# EAGLE design uMotion_v1.0 (EAGLE 9.2.1)

## Sheet 1 of 3
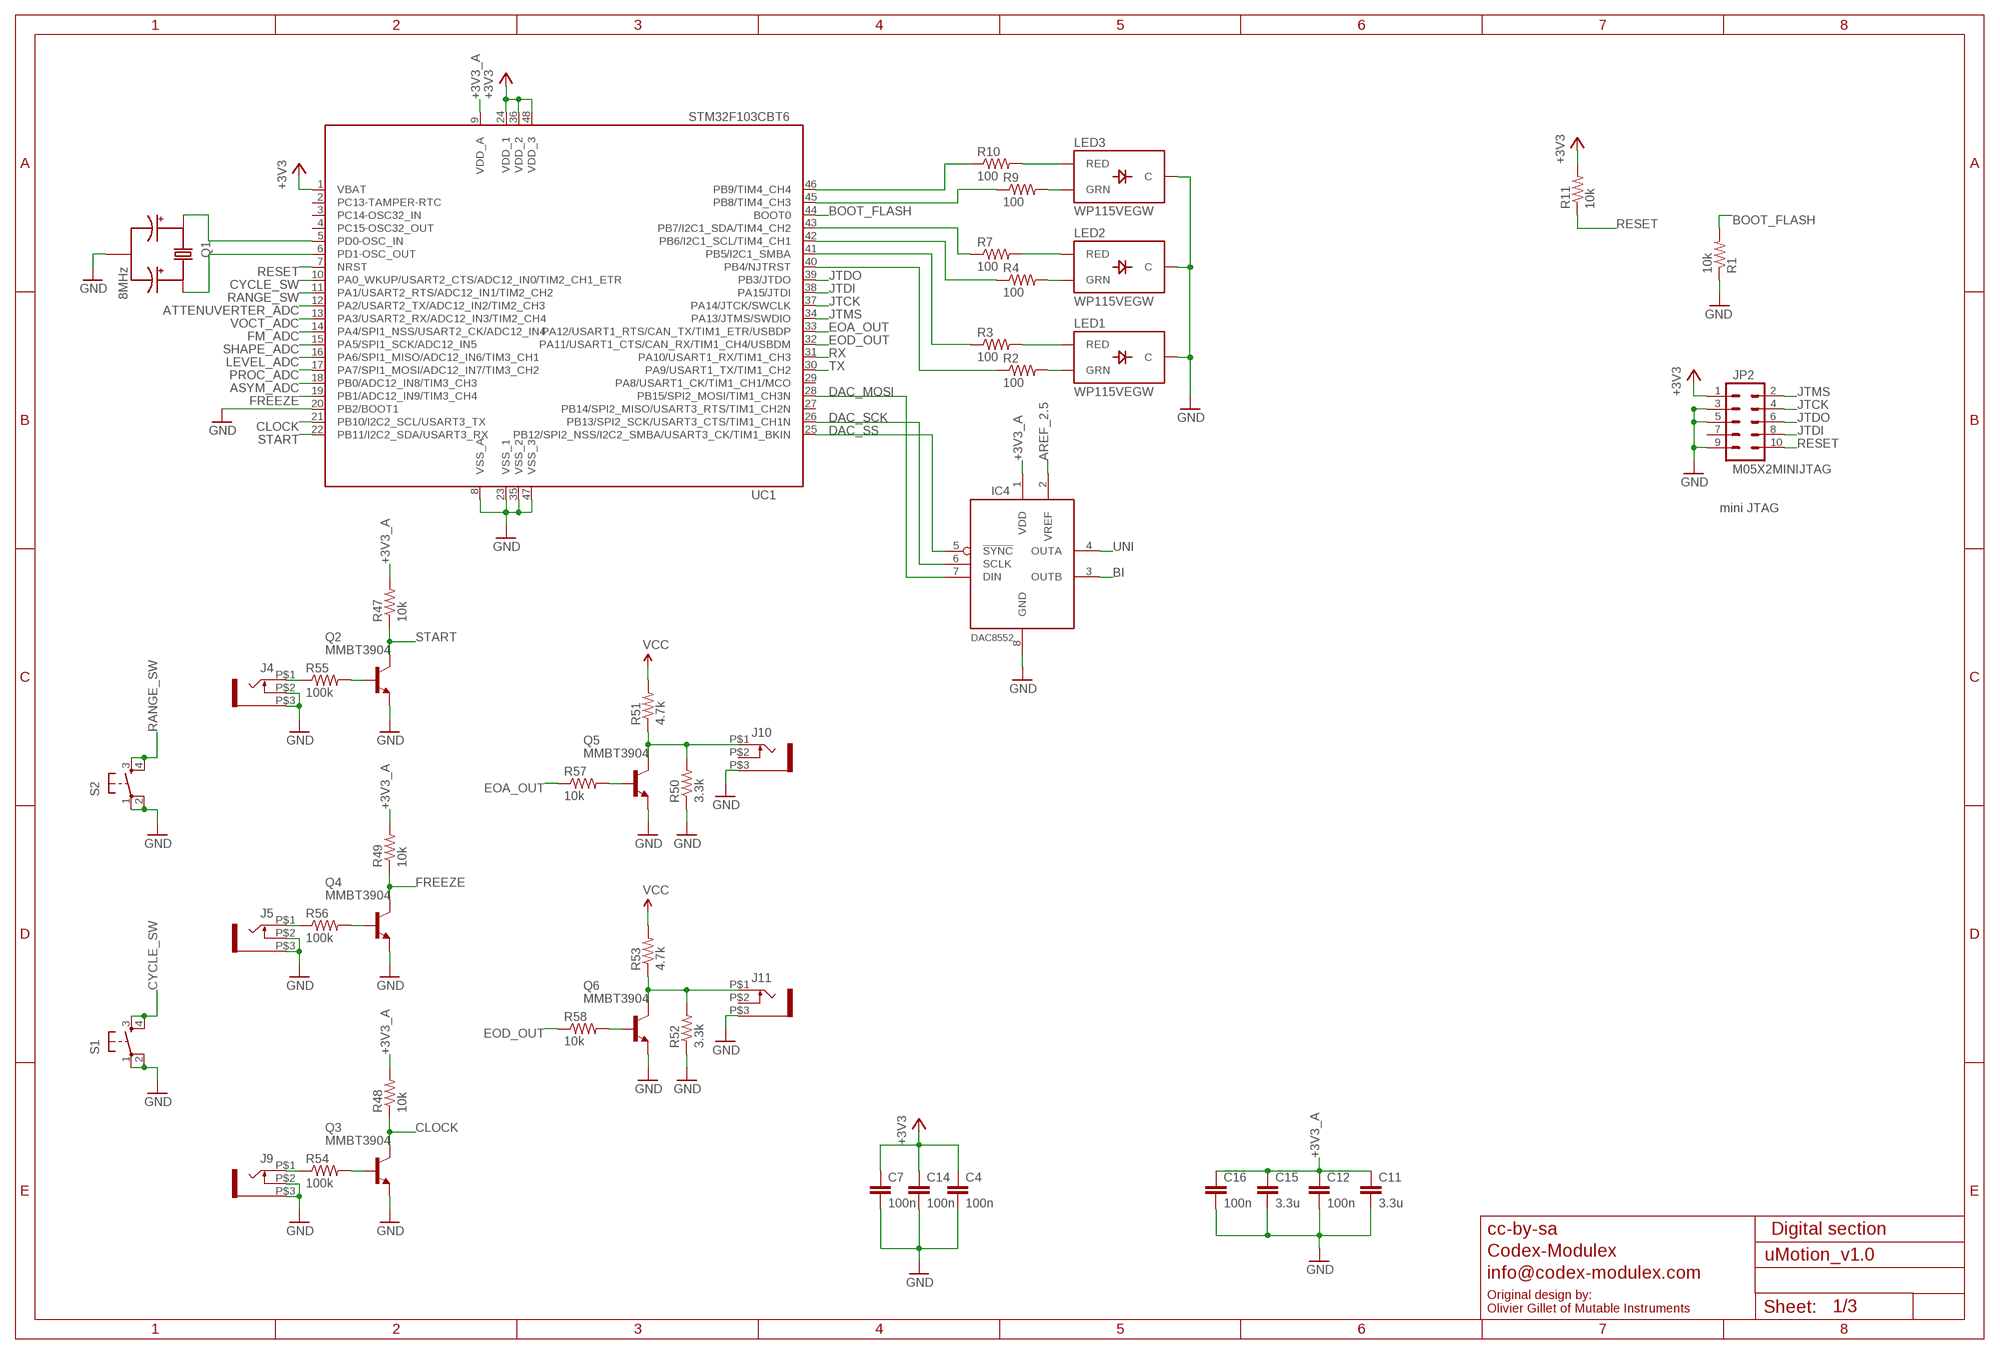
[diagram p0: schematic, sheet 1]

### Parts
C4  100n  PARTS_AMAN_CAPACITOR  [PARTS_AMAN_RESISTOR_0603]
C7  100n  PARTS_AMAN_CAPACITOR  [PARTS_AMAN_RESISTOR_0603]
C11  3.3u  PARTS_AMAN_CAPACITOR  [PARTS_AMAN_RESISTOR_0603]
C12  100n  PARTS_AMAN_CAPACITOR  [PARTS_AMAN_RESISTOR_0603]
C14  100n  PARTS_AMAN_CAPACITOR  [PARTS_AMAN_RESISTOR_0603]
C15  3.3u  PARTS_AMAN_CAPACITOR  [PARTS_AMAN_RESISTOR_0603]
C16  100n  PARTS_AMAN_CAPACITOR  [PARTS_AMAN_RESISTOR_0603]
IC4  DAC8552  [MSOP-8]
J4  WQP-PJ301M-12_JACK  [WQP-PJ301M-12_JACK]
J5  WQP-PJ301M-12_JACK  [WQP-PJ301M-12_JACK]
J9  WQP-PJ301M-12_JACK  [WQP-PJ301M-12_JACK]
J10  WQP-PJ301M-12_JACK  [WQP-PJ301M-12_JACK]
J11  WQP-PJ301M-12_JACK  [WQP-PJ301M-12_JACK]
JP2  M05X2MINIJTAG  [2X5-1.27]
LED1  WP115VEGW  LED-BICOLOR-THROUGHHOLE  [LED-BICOLOR-THROUGHHOLE]
LED2  WP115VEGW  LED-BICOLOR-THROUGHHOLE  [LED-BICOLOR-THROUGHHOLE]
LED3  WP115VEGW  LED-BICOLOR-THROUGHHOLE  [LED-BICOLOR-THROUGHHOLE]
Q1  8MHz  INSTRUO_CRYSTAL_SMALLER  [INSTRUO_CRYSTAL_SMALLER]
Q2  MMBT3904  MMBT3904LT1-NPN-SOT23-BEC  [SOT23-BEC]
Q3  MMBT3904  MMBT3904LT1-NPN-SOT23-BEC  [SOT23-BEC]
Q4  MMBT3904  MMBT3904LT1-NPN-SOT23-BEC  [SOT23-BEC]
Q5  MMBT3904  MMBT3904LT1-NPN-SOT23-BEC  [SOT23-BEC]
Q6  MMBT3904  MMBT3904LT1-NPN-SOT23-BEC  [SOT23-BEC]
R1  10k  PARTS_AMAN_RESISTOR  [PARTS_AMAN_RESISTOR_0603]
R2  100  PARTS_AMAN_RESISTOR  [PARTS_AMAN_RESISTOR_0603]
R3  100  PARTS_AMAN_RESISTOR  [PARTS_AMAN_RESISTOR_0603]
R4  100  PARTS_AMAN_RESISTOR  [PARTS_AMAN_RESISTOR_0603]
R7  100  PARTS_AMAN_RESISTOR  [PARTS_AMAN_RESISTOR_0603]
R9  100  PARTS_AMAN_RESISTOR  [PARTS_AMAN_RESISTOR_0603]
R10  100  PARTS_AMAN_RESISTOR  [PARTS_AMAN_RESISTOR_0603]
R11  10k  PARTS_AMAN_RESISTOR  [PARTS_AMAN_RESISTOR_0603]
R47  10k  PARTS_AMAN_RESISTOR  [PARTS_AMAN_RESISTOR_0603]
R48  10k  PARTS_AMAN_RESISTOR  [PARTS_AMAN_RESISTOR_0603]
R49  10k  PARTS_AMAN_RESISTOR  [PARTS_AMAN_RESISTOR_0603]
R50  3.3k  PARTS_AMAN_RESISTOR  [PARTS_AMAN_RESISTOR_0603]
R51  4.7k  PARTS_AMAN_RESISTOR  [PARTS_AMAN_RESISTOR_0603]
R52  3.3k  PARTS_AMAN_RESISTOR  [PARTS_AMAN_RESISTOR_0603]
R53  4.7k  PARTS_AMAN_RESISTOR  [PARTS_AMAN_RESISTOR_0603]
R54  100k  PARTS_AMAN_RESISTOR  [PARTS_AMAN_RESISTOR_0603]
R55  100k  PARTS_AMAN_RESISTOR  [PARTS_AMAN_RESISTOR_0603]
R56  100k  PARTS_AMAN_RESISTOR  [PARTS_AMAN_RESISTOR_0603]
R57  10k  PARTS_AMAN_RESISTOR  [PARTS_AMAN_RESISTOR_0603]
R58  10k  PARTS_AMAN_RESISTOR  [PARTS_AMAN_RESISTOR_0603]
S1  TAC_SWITCHPTH  [TACTILE-PTH]
S2  TAC_SWITCHPTH  [TACTILE-PTH]
UC1  STM32F103CBT6  STM32F103CB  [LQFP48]

### Nets
+3V3: C4.1 C7.1 C14.1 JP2.1 R11.2 UC1.1(VBAT) UC1.24(VDD_1) UC1.36(VDD_2) UC1.48(VDD_3) ; also sheet 3
+3V3_A: C11.1 C12.1 C15.1 C16.1 IC4.1(VDD) R47.2 R48.2 R49.2 UC1.9(VDD_A) ; also sheet 2,3
AREF_2.5: IC4.2(VREF) ; also sheet 3
ASYM_ADC: UC1.18(PB0/ADC12_IN8/TIM3_CH3) ; also sheet 2
ATTENUVERTER_ADC: UC1.12(PA2/USART2_TX/ADC12_IN2/TIM2_CH3) ; also sheet 2
BI: IC4.3(OUTB) ; also sheet 2
BOOT_FLASH: R1.2 UC1.44(BOOT0)
CLOCK: Q3.C R48.1 UC1.21(PB10/I2C2_SCL/USART3_TX)
CYCLE_SW: S1.3 S1.4 UC1.10(PA0_WKUP/USART2_CTS/ADC12_IN0/TIM2_CH1_ETR)
DAC_MOSI: IC4.7(DIN) UC1.28(PB15/SPI2_MOSI/TIM1_CH3N)
DAC_SCK: IC4.6(SCLK) UC1.26(PB13/SPI2_SCK/USART3_CTS/TIM1_CH1N)
DAC_SS: IC4.5(!SYNC) UC1.25(PB12/SPI2_NSS/I2C2_SMBA/USART3_CK/TIM1_BKIN)
EOA_OUT: R57.1 UC1.33(PA12/USART1_RTS/CAN_TX/TIM1_ETR/USBDP)
EOD_OUT: R58.1 UC1.32(PA11/USART1_CTS/CAN_RX/TIM1_CH4/USBDM)
FM_ADC: UC1.14(PA4/SPI1_NSS/USART2_CK/ADC12_IN4) ; also sheet 2
FREEZE: Q4.C R49.1 UC1.19(PB1/ADC12_IN9/TIM3_CH4)
GND: C4.2 C7.2 C11.2 C12.2 C14.2 C15.2 C16.2 IC4.8(GND) J4.P$2 J4.P$3 J5.P$2 J5.P$3 J9.P$2 J9.P$3 J10.P$3 J11.P$3 JP2.3 JP2.5 JP2.9 LED1.2(C) LED2.2(C) LED3.2(C) Q1.GND Q2.E Q3.E Q4.E Q5.E Q6.E R1.1 R50.1 R52.1 S1.1 S1.2 S2.1 S2.2 UC1.8(VSS_A) UC1.20(PB2/BOOT1) UC1.23(VSS_1) UC1.35(VSS_2) UC1.47(VSS_3) ; also sheet 2,3
JTCK: JP2.4 UC1.37(PA14/JTCK/SWCLK)
JTDI: JP2.8 UC1.38(PA15/JTDI)
JTDO: JP2.6 UC1.39(PB3/JTDO)
JTMS: JP2.2 UC1.34(PA13/JTMS/SWDIO)
LEVEL_ADC: UC1.16(PA6/SPI1_MISO/ADC12_IN6/TIM3_CH1) ; also sheet 2
N$7: Q1.X2 UC1.6(PD1-OSC_OUT)
N$8: Q1.X1 UC1.5(PD0-OSC_IN)
N$21: J5.P$1 R56.1
N$23: Q4.B R56.2
N$24: J9.P$1 R54.1
N$25: Q3.B R54.2
N$26: Q6.B R58.2
N$27: J11.P$1 Q6.C R52.2 R53.1
N$28: LED3.3(RED) R10.2
N$29: LED3.1(GRN) R9.2
N$30: LED2.3(RED) R7.2
N$31: LED2.1(GRN) R4.2
N$32: LED1.3(RED) R3.2
N$33: LED1.1(GRN) R2.2
N$34: R10.1 UC1.46(PB9/TIM4_CH4)
N$35: R9.1 UC1.45(PB8/TIM4_CH3)
N$36: R7.1 UC1.43(PB7/I2C1_SDA/TIM4_CH2)
N$37: R4.1 UC1.42(PB6/I2C1_SCL/TIM4_CH1)
N$38: R3.1 UC1.41(PB5/I2C1_SMBA)
N$39: R2.1 UC1.40(PB4/NJTRST)
N$44: J10.P$1 Q5.C R50.2 R51.1
N$47: Q5.B R57.2
N$57: J4.P$1 R55.1
N$66: Q2.B R55.2
PROC_ADC: UC1.17(PA7/SPI1_MOSI/ADC12_IN7/TIM3_CH2) ; also sheet 2
RANGE_SW: S2.3 S2.4 UC1.11(PA1/USART2_RTS/ADC12_IN1/TIM2_CH2)
RESET: JP2.10 R11.1 UC1.7(NRST)
RX: UC1.31(PA10/USART1_RX/TIM1_CH3)
SHAPE_ADC: UC1.15(PA5/SPI1_SCK/ADC12_IN5) ; also sheet 2
START: Q2.C R47.1 UC1.22(PB11/I2C2_SDA/USART3_RX)
TX: UC1.30(PA9/USART1_TX/TIM1_CH2)
UNI: IC4.4(OUTA) ; also sheet 2
VCC: R51.2 R53.2 ; also sheet 2,3
VOCT_ADC: UC1.13(PA3/USART2_RX/ADC12_IN3/TIM2_CH4) ; also sheet 2
Unconnected: J10.P$2 J11.P$2 JP2.7 UC1.2(PC13-TAMPER-RTC) UC1.3(PC14-OSC32_IN) UC1.4(PC15-OSC32_OUT) UC1.27(PB14/SPI2_MISO/USART3_RTS/TIM1_CH2N) UC1.29(PA8/USART1_CK/TIM1_CH1/MCO)

### Notes on the sheet
- mini JTAG
- cc-by-sa | Digital section
- Codex-Modulex
- info@codex-modulex.com
- Original design by:
  Olivier Gillet of Mutable Instruments

## Sheet 2 of 3
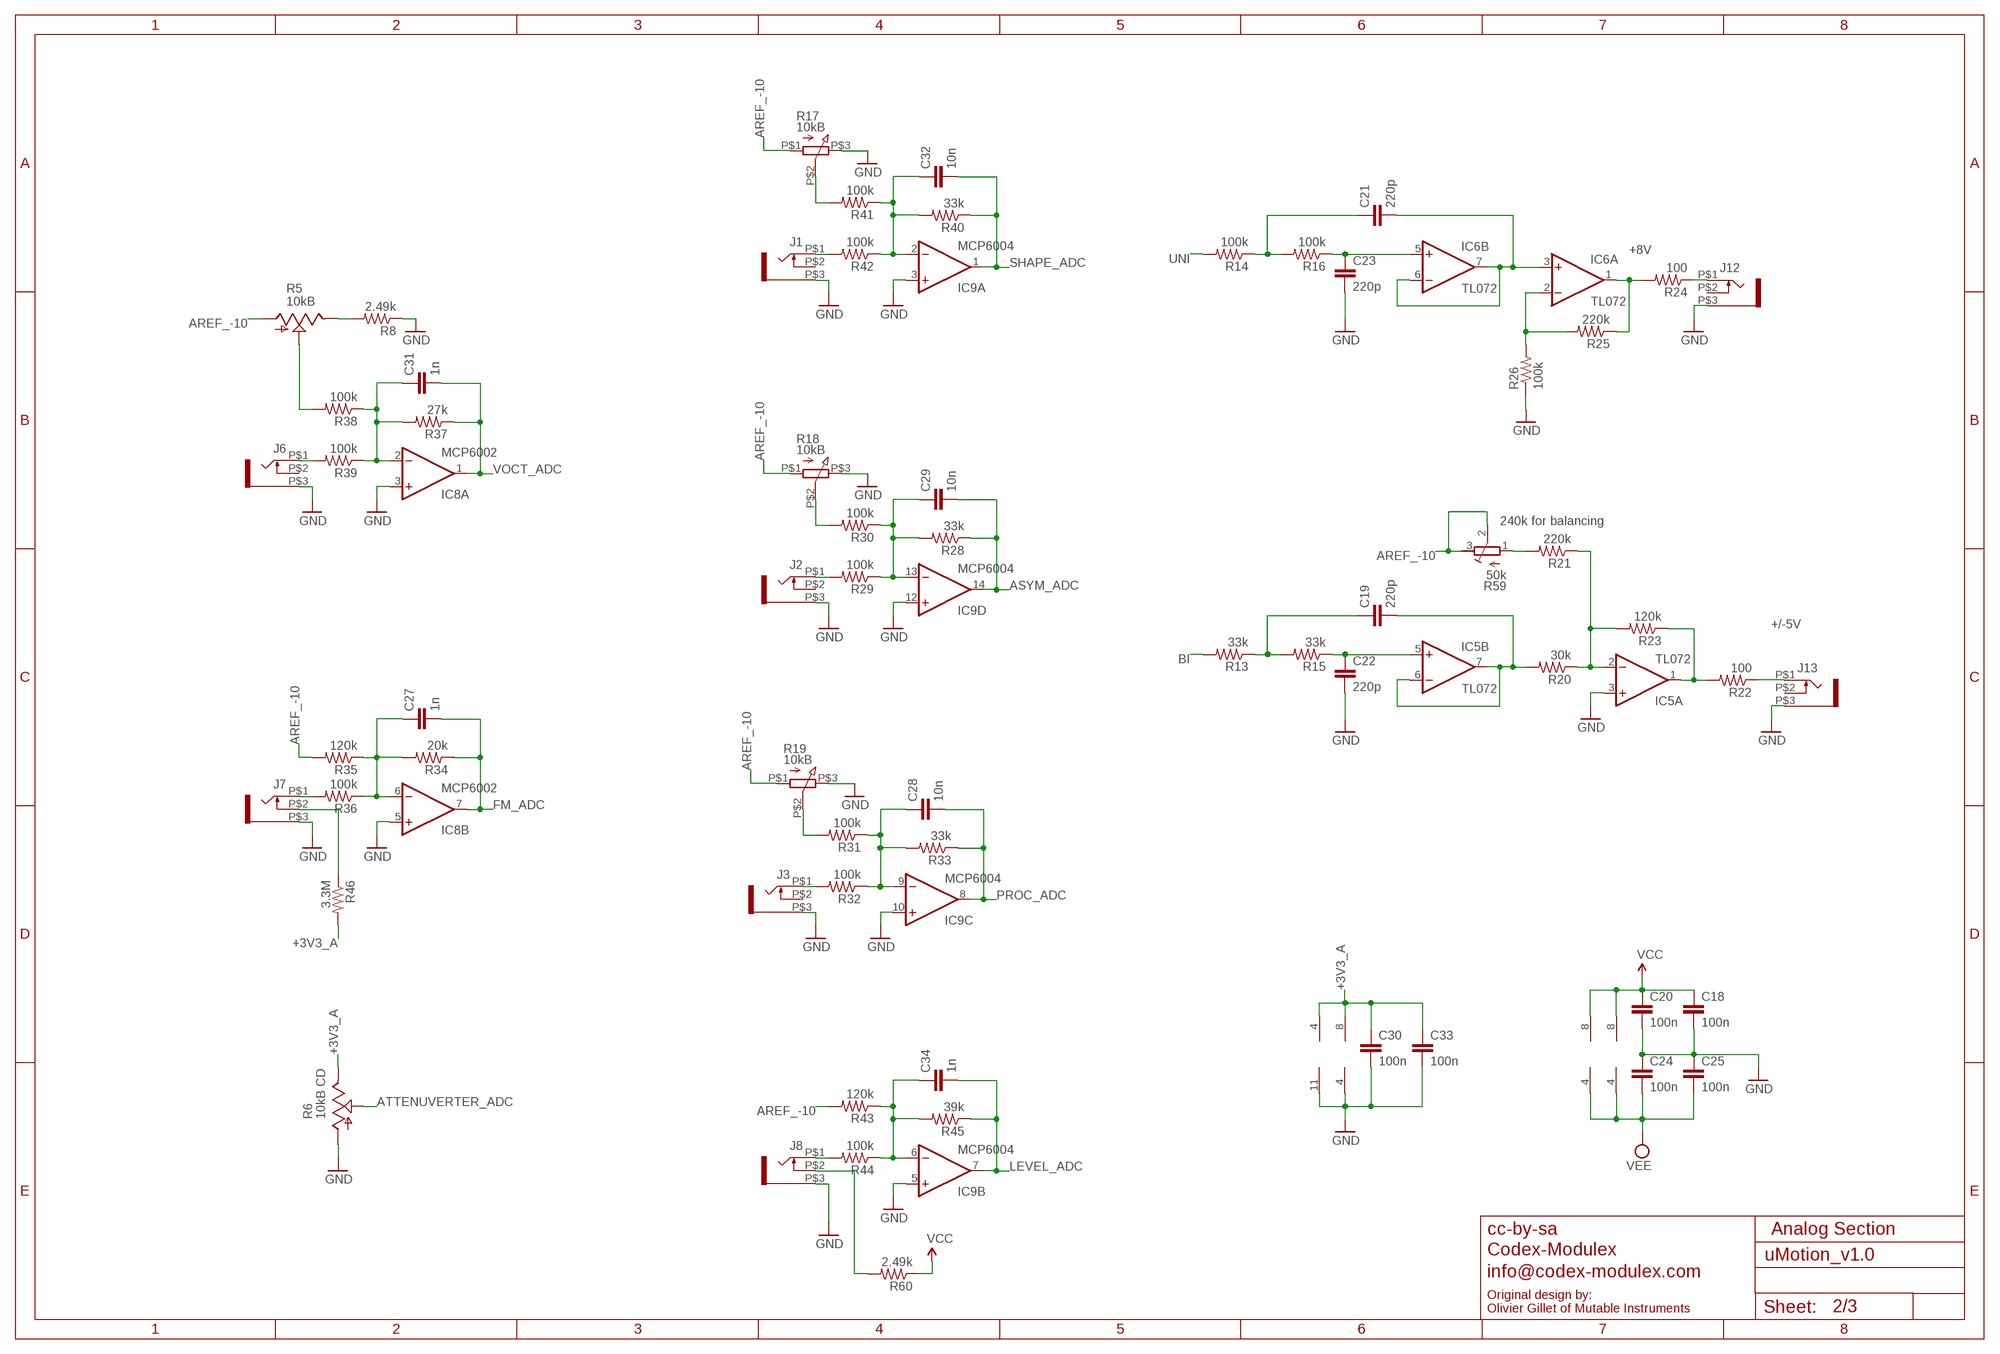
[diagram p1: schematic, sheet 2]

### Parts
C18  100n  PARTS_AMAN_CAPACITOR  [PARTS_AMAN_RESISTOR_0603]
C19  220p  PARTS_AMAN_CAPACITOR  [PARTS_AMAN_RESISTOR_0603]
C20  100n  PARTS_AMAN_CAPACITOR  [PARTS_AMAN_RESISTOR_0603]
C21  220p  PARTS_AMAN_CAPACITOR  [PARTS_AMAN_RESISTOR_0603]
C22  220p  PARTS_AMAN_CAPACITOR  [PARTS_AMAN_RESISTOR_0603]
C23  220p  PARTS_AMAN_CAPACITOR  [PARTS_AMAN_RESISTOR_0603]
C24  100n  PARTS_AMAN_CAPACITOR  [PARTS_AMAN_RESISTOR_0603]
C25  100n  PARTS_AMAN_CAPACITOR  [PARTS_AMAN_RESISTOR_0603]
C27  1n  PARTS_AMAN_CAPACITOR  [PARTS_AMAN_RESISTOR_0603]
C28  10n  PARTS_AMAN_CAPACITOR  [PARTS_AMAN_RESISTOR_0603]
C29  10n  PARTS_AMAN_CAPACITOR  [PARTS_AMAN_RESISTOR_0603]
C30  100n  PARTS_AMAN_CAPACITOR  [PARTS_AMAN_RESISTOR_0603]
C31  1n  PARTS_AMAN_CAPACITOR  [PARTS_AMAN_RESISTOR_0603]
C32  10n  PARTS_AMAN_CAPACITOR  [PARTS_AMAN_RESISTOR_0603]
C33  100n  PARTS_AMAN_CAPACITOR  [PARTS_AMAN_RESISTOR_0603]
C34  1n  PARTS_AMAN_CAPACITOR  [PARTS_AMAN_RESISTOR_0603]
IC5  TL072  TL072D  [SO08]
IC6  TL072  TL072D  [SO08]
IC8  MCP6002  TL072D  [SO08]
IC9  MCP6004  TL074D  [SO14]
J1  WQP-PJ301M-12_JACK  [WQP-PJ301M-12_JACK]
J2  WQP-PJ301M-12_JACK  [WQP-PJ301M-12_JACK]
J3  WQP-PJ301M-12_JACK  [WQP-PJ301M-12_JACK]
J6  WQP-PJ301M-12_JACK  [WQP-PJ301M-12_JACK]
J7  WQP-PJ301M-12_JACK  [WQP-PJ301M-12_JACK]
J8  WQP-PJ301M-12_JACK  [WQP-PJ301M-12_JACK]
J12  WQP-PJ301M-12_JACK  [WQP-PJ301M-12_JACK]
J13  WQP-PJ301M-12_JACK  [WQP-PJ301M-12_JACK]
R5  10kB  POT_USVERTICAL_PS  [ALPS_POT_VERTICAL_PS]
R6  10kB CD  POT_USVERTICAL_PS  [ALPS_POT_VERTICAL_PS]
R8  2.49k  PARTS_AMAN_RESISTOR  [PARTS_AMAN_RESISTOR_0603]
R13  33k  PARTS_AMAN_RESISTOR  [PARTS_AMAN_RESISTOR_0603]
R14  100k  PARTS_AMAN_RESISTOR  [PARTS_AMAN_RESISTOR_0603]
R15  33k  PARTS_AMAN_RESISTOR  [PARTS_AMAN_RESISTOR_0603]
R16  100k  PARTS_AMAN_RESISTOR  [PARTS_AMAN_RESISTOR_0603]
R17  10kB  INSTRUO_Q-POT2  [INSTRUO_Q-POT2]
R18  10kB  INSTRUO_Q-POT2  [INSTRUO_Q-POT2]
R19  10kB  INSTRUO_Q-POT2  [INSTRUO_Q-POT2]
R20  30k  PARTS_AMAN_RESISTOR  [PARTS_AMAN_RESISTOR_0603]
R21  220k  PARTS_AMAN_RESISTOR  [PARTS_AMAN_RESISTOR_0603]
R22  100  PARTS_AMAN_RESISTOR  [PARTS_AMAN_RESISTOR_0603]
R23  120k  PARTS_AMAN_RESISTOR  [PARTS_AMAN_RESISTOR_0603]
R24  100  PARTS_AMAN_RESISTOR  [PARTS_AMAN_RESISTOR_0603]
R25  220k  PARTS_AMAN_RESISTOR  [PARTS_AMAN_RESISTOR_0603]
R26  100k  PARTS_AMAN_RESISTOR  [PARTS_AMAN_RESISTOR_0603]
R28  33k  PARTS_AMAN_RESISTOR  [PARTS_AMAN_RESISTOR_0603]
R29  100k  PARTS_AMAN_RESISTOR  [PARTS_AMAN_RESISTOR_0603]
R30  100k  PARTS_AMAN_RESISTOR  [PARTS_AMAN_RESISTOR_0603]
R31  100k  PARTS_AMAN_RESISTOR  [PARTS_AMAN_RESISTOR_0603]
R32  100k  PARTS_AMAN_RESISTOR  [PARTS_AMAN_RESISTOR_0603]
R33  33k  PARTS_AMAN_RESISTOR  [PARTS_AMAN_RESISTOR_0603]
R34  20k  PARTS_AMAN_RESISTOR  [PARTS_AMAN_RESISTOR_0603]
R35  120k  PARTS_AMAN_RESISTOR  [PARTS_AMAN_RESISTOR_0603]
R36  100k  PARTS_AMAN_RESISTOR  [PARTS_AMAN_RESISTOR_0603]
R37  27k  PARTS_AMAN_RESISTOR  [PARTS_AMAN_RESISTOR_0603]
R38  100k  PARTS_AMAN_RESISTOR  [PARTS_AMAN_RESISTOR_0603]
R39  100k  PARTS_AMAN_RESISTOR  [PARTS_AMAN_RESISTOR_0603]
R40  33k  PARTS_AMAN_RESISTOR  [PARTS_AMAN_RESISTOR_0603]
R41  100k  PARTS_AMAN_RESISTOR  [PARTS_AMAN_RESISTOR_0603]
R42  100k  PARTS_AMAN_RESISTOR  [PARTS_AMAN_RESISTOR_0603]
R43  120k  PARTS_AMAN_RESISTOR  [PARTS_AMAN_RESISTOR_0603]
R44  100k  PARTS_AMAN_RESISTOR  [PARTS_AMAN_RESISTOR_0603]
R45  39k  PARTS_AMAN_RESISTOR  [PARTS_AMAN_RESISTOR_0603]
R46  3.3M  PARTS_AMAN_RESISTOR  [PARTS_AMAN_RESISTOR_0603]
R59  50k  R-TRIMM3296X  [RTRIM3296X]
R60  2.49k  R-US_R0805  [R0805]

### Nets
+3V3_A: C30.1 C33.1 IC8.8(P:V+) IC9.4(P:V+) R6.P$1(E) R46.2 ; also sheet 1,3
AREF_-10: R5.P$3(A) R17.P$1 R18.P$1 R19.P$1 R35.2 R43.2 R59.2(S) R59.3(A) ; also sheet 3
ASYM_ADC: C29.2 IC9.14(D:OUT) R28.1 ; also sheet 1
ATTENUVERTER_ADC: R6.P$2(S) ; also sheet 1
BI: R13.2 ; also sheet 1
BI_OUT: IC5.1(A:OUT) R22.2 R23.1
F_CV: IC5.2(A:-IN) R20.1 R21.1 R23.2
FM_ADC: C27.2 IC8.7(B:OUT) R34.1 ; also sheet 1
GND: C18.2 C20.2 C22.2 C23.2 C24.1 C25.1 C30.2 C33.2 IC5.3(A:+IN) IC8.3(A:+IN) IC8.4(P:V-) IC8.5(B:+IN) IC9.3(A:+IN) IC9.5(B:+IN) IC9.10(C:+IN) IC9.11(P:V-) IC9.12(D:+IN) J1.P$3 J2.P$3 J3.P$3 J6.P$3 J7.P$3 J8.P$3 J12.P$3 J13.P$3 R6.P$3(A) R8.1 R17.P$3 R18.P$3 R19.P$3 R26.1 ; also sheet 1,3
LEVEL_ADC: C34.2 IC9.7(B:OUT) R45.1 ; also sheet 1
N$1: J1.P$1 R42.2
N$2: C32.1 IC9.2(A:-IN) R40.2 R41.1 R42.1
N$3: R17.P$2 R41.2
N$4: J2.P$1 R29.2
N$5: C29.1 IC9.13(D:-IN) R28.2 R29.1 R30.1
N$6: J7.P$2 R46.1
N$9: R18.P$2 R30.2
N$10: J3.P$1 R32.2
N$11: C28.1 IC9.9(C:-IN) R31.1 R32.1 R33.2
N$12: R19.P$2 R31.2
N$13: J8.P$1 R44.2
N$14: C34.1 IC9.6(B:-IN) R43.1 R44.1 R45.2
N$15: J6.P$1 R39.2
N$16: C31.1 IC8.2(A:-IN) R37.2 R38.1 R39.1
N$17: R5.P$2(S) R38.2
N$18: J13.P$1 R22.1
N$19: R5.P$1(E) R8.2
N$20: J7.P$1 R36.2
N$22: C27.1 IC8.6(B:-IN) R34.2 R35.1 R36.1
N$40: R21.2 R59.1(E)
N$41: IC6.2(A:-IN) R25.2 R26.2
N$42: C19.2 IC5.6(B:-IN) IC5.7(B:OUT) R20.2
N$43: C22.1 IC5.5(B:+IN) R15.1
N$45: C19.1 R13.1 R15.2
N$46: IC6.1(A:OUT) R24.2 R25.1
N$48: J8.P$2 R60.2
N$67: C21.2 IC6.3(A:+IN) IC6.6(B:-IN) IC6.7(B:OUT)
N$69: C23.1 IC6.5(B:+IN) R16.1
N$71: C21.1 R14.1 R16.2
PROC_ADC: C28.2 IC9.8(C:OUT) R33.1 ; also sheet 1
SHAPE_ADC: C32.2 IC9.1(A:OUT) R40.1 ; also sheet 1
UNI: R14.2 ; also sheet 1
UNI_OUT: J12.P$1 R24.1
VCC: C18.1 C20.1 IC5.8(P:V+) IC6.8(P:V+) R60.1 ; also sheet 1,3
VEE: C24.2 C25.2 IC5.4(P:V-) IC6.4(P:V-) ; also sheet 3
VOCT_ADC: C31.2 IC8.1(A:OUT) R37.1 ; also sheet 1
Unconnected: J1.P$2 J2.P$2 J3.P$2 J6.P$2 J12.P$2 J13.P$2

### Notes on the sheet
- +8V
- 240k for balancing
- +/-5V
- cc-by-sa | Analog Section
- Codex-Modulex
- info@codex-modulex.com
- Original design by:
  Olivier Gillet of Mutable Instruments

## Sheet 3 of 3
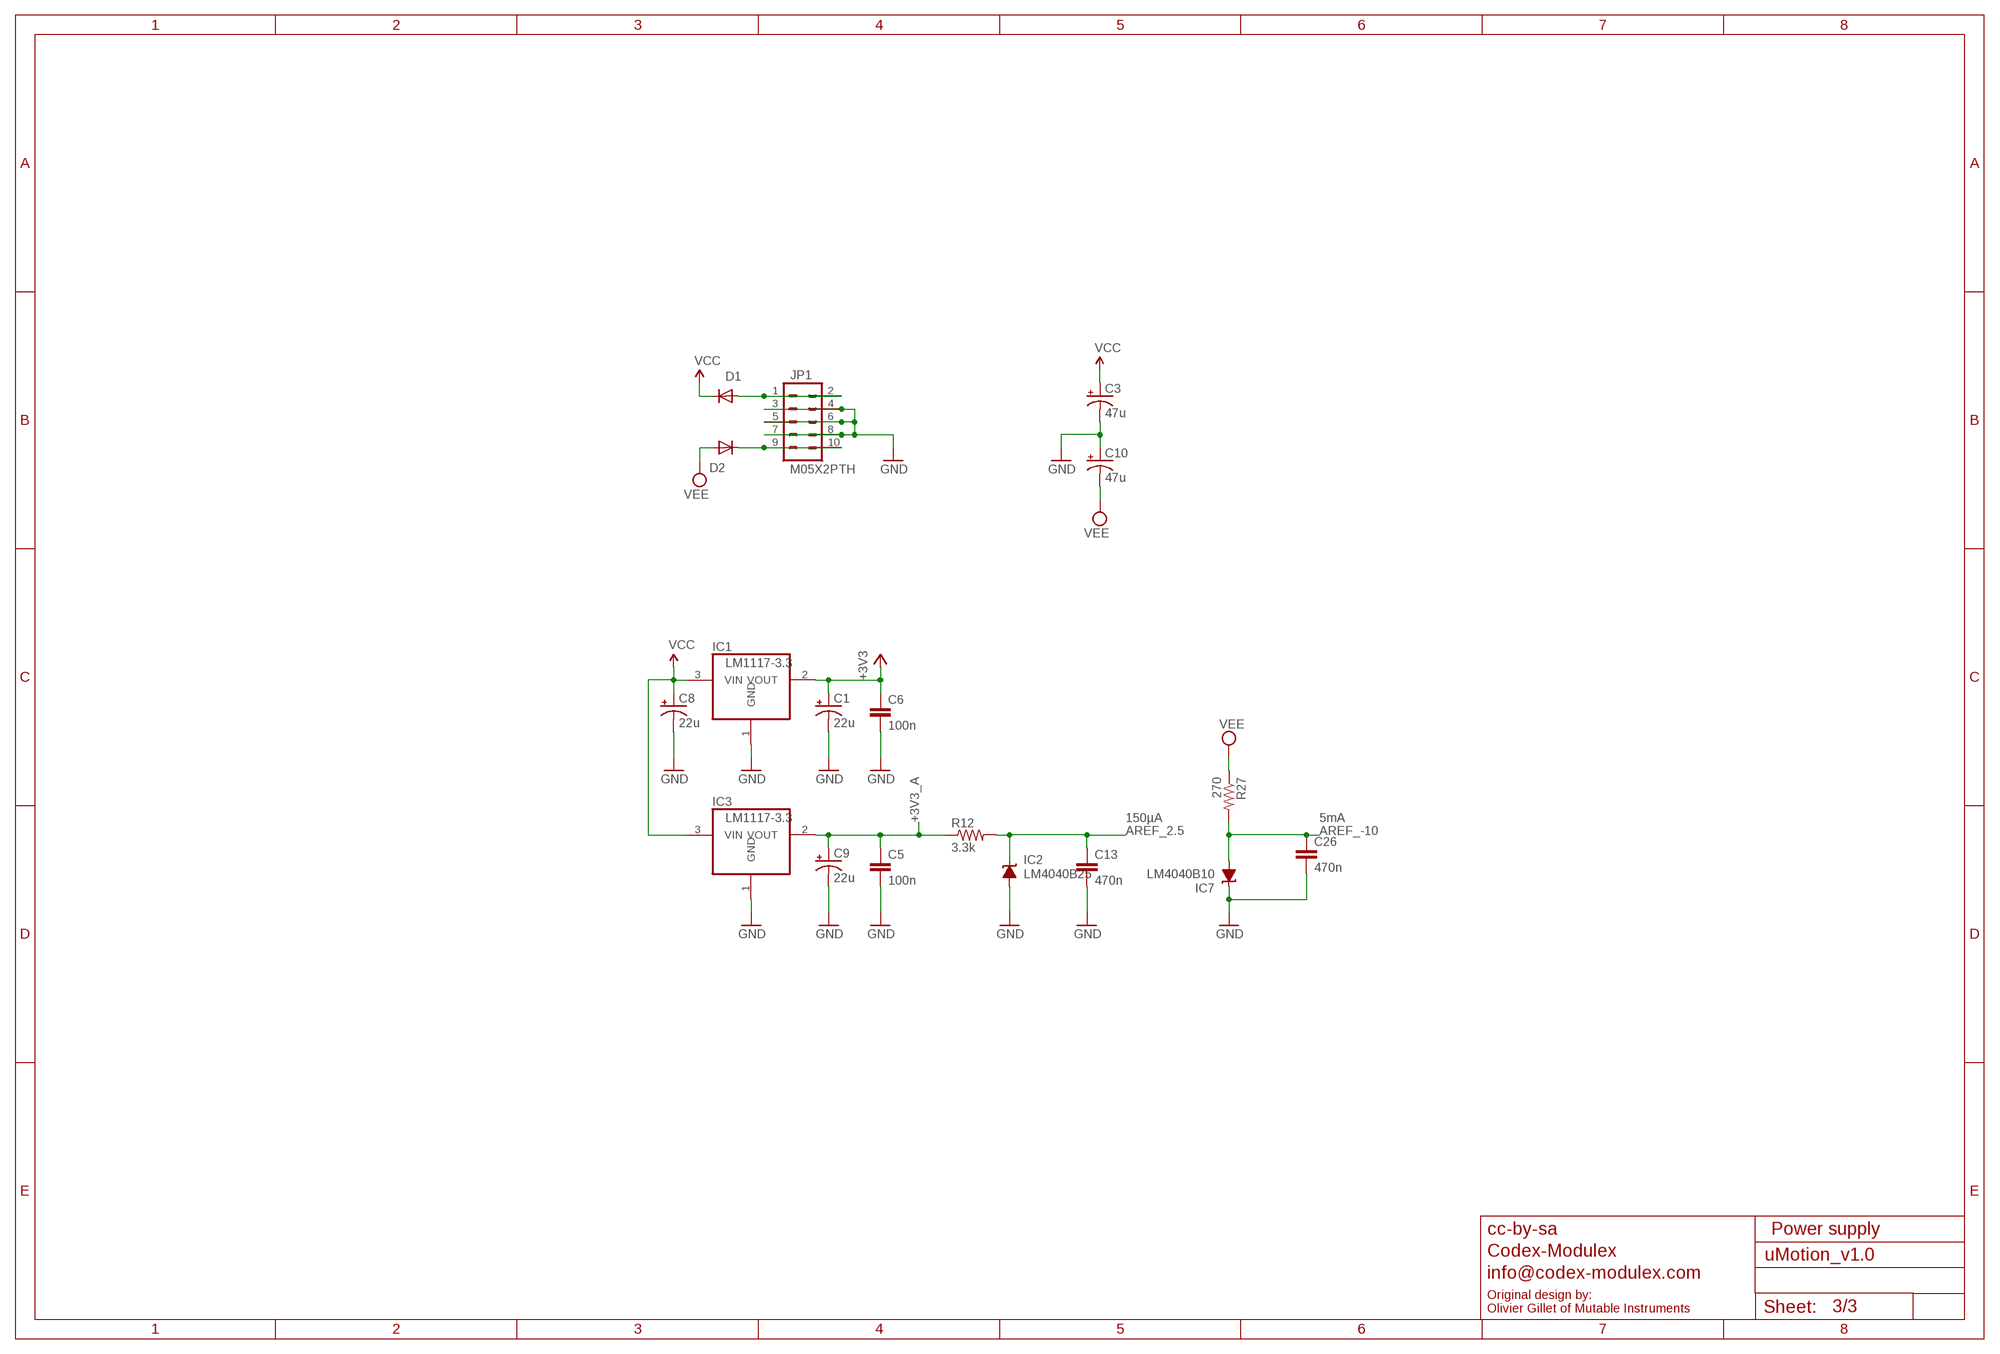
[diagram p2: schematic, sheet 3]

### Parts
C1  22u  CPOL-USC  [PANASONIC_C]
C3  47u  CPOL-USD  [PANASONIC_D]
C5  100n  PARTS_AMAN_CAPACITOR  [PARTS_AMAN_RESISTOR_0603]
C6  100n  PARTS_AMAN_CAPACITOR  [PARTS_AMAN_RESISTOR_0603]
C8  22u  CPOL-USC  [PANASONIC_C]
C9  22u  CPOL-USC  [PANASONIC_C]
C10  47u  CPOL-USD  [PANASONIC_D]
C13  470n  PARTS_AMAN_CAPACITOR  [PARTS_AMAN_RESISTOR_0603]
C26  470n  PARTS_AMAN_CAPACITOR  [PARTS_AMAN_RESISTOR_0603]
D1  1N5819HW  DIODE-SOD123  [SOD123]
D2  1N5819HW  DIODE-SOD123  [SOD123]
IC1  LM1117-3.3  REG1117  [SOT223]
IC2  LM4040B25  LM4041B12DBZ  [DBZ_R-PDSO-G3]
IC3  LM1117-3.3  REG1117  [SOT223]
IC7  LM4040B10  LM4041B12DBZ  [DBZ_R-PDSO-G3]
JP1  M05X2PTH  [AVR_ICSP]
R12  3.3k  PARTS_AMAN_RESISTOR  [PARTS_AMAN_RESISTOR_0603]
R27  270  PARTS_AMAN_RESISTOR  [PARTS_AMAN_RESISTOR_0603]

### Nets
+3V3: C1.+ C6.1 IC1.2(VOUT) ; also sheet 1
+3V3_A: C5.1 C9.+ IC3.2(VOUT) R12.1 ; also sheet 1,2
AREF_2.5: C13.1 IC2.1(C) R12.2 ; also sheet 1
AREF_-10: C26.1 IC7.2(A) R27.2 ; also sheet 2
GND: C1.- C3.- C5.2 C6.2 C8.- C9.- C10.+ C13.2 C26.2 IC1.1(GND) IC2.2(A) IC3.1(GND) IC7.1(C) JP1.3 JP1.4 JP1.5 JP1.6 JP1.7 JP1.8 ; also sheet 1,2
N$56: D1.A JP1.1 JP1.2
N$64: D2.C JP1.9 JP1.10
VCC: C3.+ C8.+ D1.C IC1.3(VIN) IC3.3(VIN) ; also sheet 1,2
VEE: C10.- D2.A R27.1 ; also sheet 2

### Notes on the sheet
- 150µA | 5mA
- cc-by-sa | Power supply
- Codex-Modulex
- info@codex-modulex.com
- Original design by:
  Olivier Gillet of Mutable Instruments

## Library data of the parts
C1 C3 C8-C10 = rcl:CPOL-US: POLARIZED CAPACITOR, American symbol
C4-C7 C11-C16 C18-C34 = atom_v1_1_board_2:PARTS_AMAN_CAPACITOR
D1 D2 = diode:DIODE-: DIODE
IC1 IC3 = og-vreg:REG1117: 800mA and 1A Low Dropout (LDO) Positive Regulator 1.8V, 2.5V, 2.85V, 3.3V, 5V, and Adj
IC2 IC7 = texas:LM4041: PRECISION MICROPOWER SHUNT VOLTAGE REFERENCE Source: http://focus.ti.com/lit/ds/slcs146e/slcs146e.pdf
IC4 = og-dac:DAC8552
IC5 IC6 IC8 = linear:TL072: OP AMP
IC9 = gm-ics:TL074: OP AMP
J1-J13 = thonkiconn:WQP-PJ301M-12_JACK
JP1 JP2 = og-header:M05X2: Header 5x2 Standard 10-pin dual row 0.1" header. Commonly used with AVR-ISP. Use with Spark Fun Electronics SKU: PRT-00778
LED1-LED3 = og-leds:LED-BICOLOR-THROUGHHOLE
Q1 = uClouds_002_:INSTRUO_CRYSTAL_SMALLER: CSTCE16M0V53-R0
Q2-Q6 = transistor:*-NPN-: NPN Transistror BF959 corrected 2008.03.06
R1-R4 R7-R16 R20-R58 = atom_v1_1_board_2:PARTS_AMAN_RESISTOR
R5 R6 = pot-alps:POT_US
R17-R19 = uClouds_002_:INSTRUO_Q-POT2
R59 = rcl:R-TRIMM: Trimm resistor
R60 = resistor:R-US_: RESISTOR, American symbol
S1 S2 = uClouds_002:TAC_SWITCH: Momentary Switch Button commonly used for reset or general input. Spark Fun Electronics SKU : COM-00097
UC1 = stm32:STM32F103CB

## Board
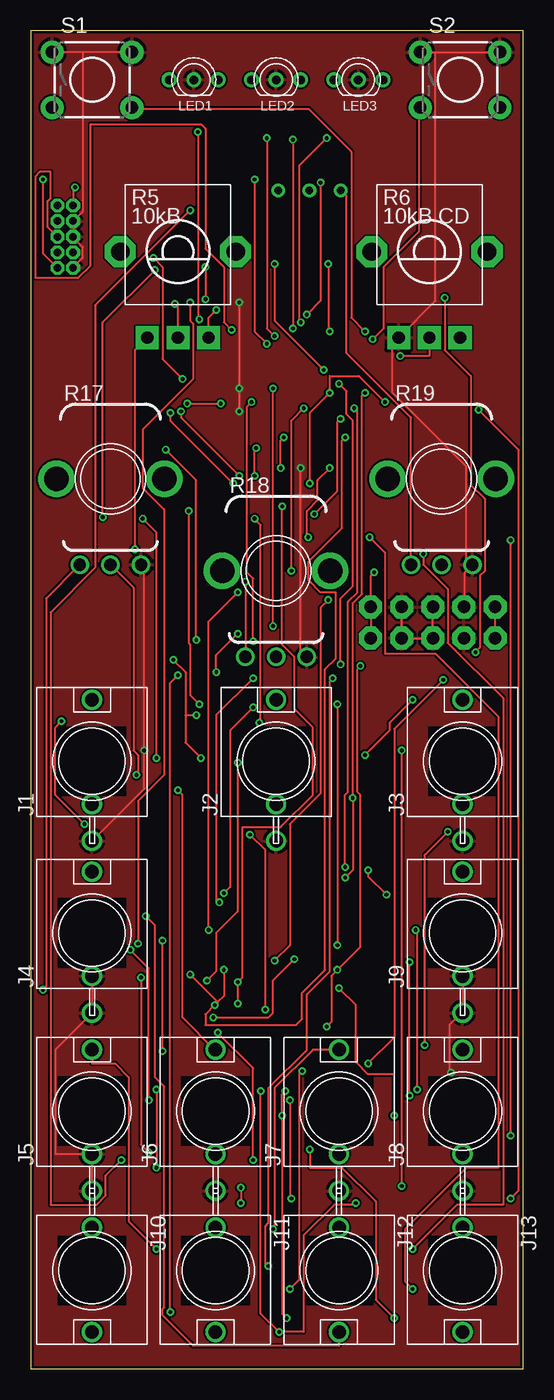
[diagram p3: board, top side]
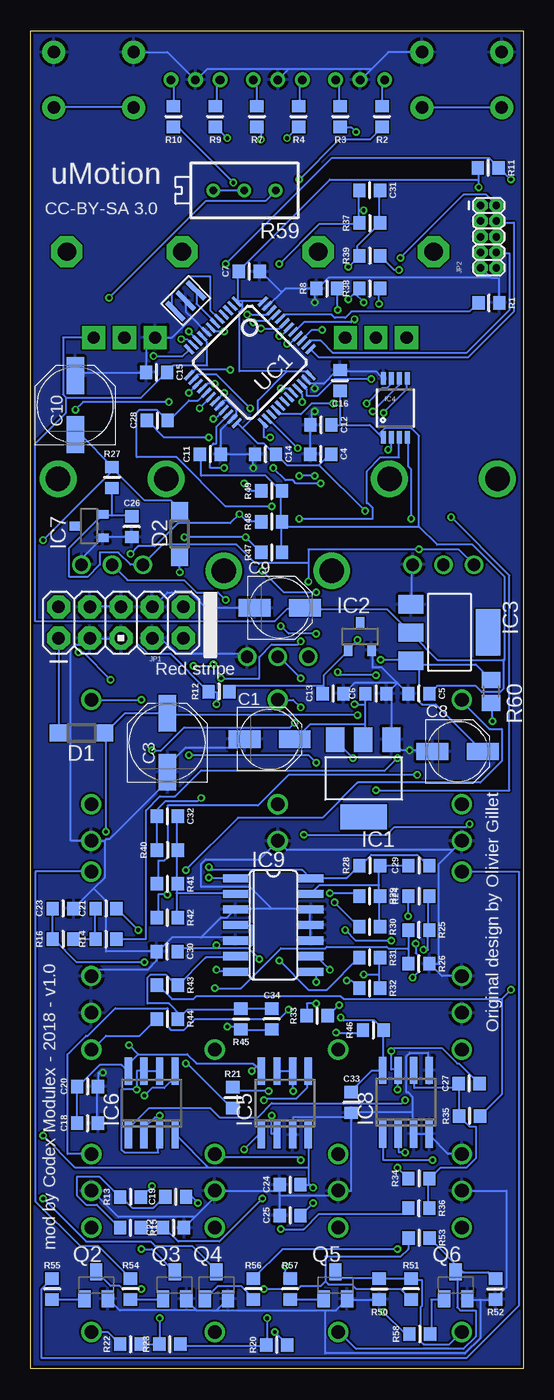
[diagram p4: board, bottom side, seen from below]

Size 40.14 x 109 mm. Coordinates in mm from the lower left corner, seen from the top.
Outline: 0,0 40.14,0 40.14,109 0,109 0,0
Copper layers (1*16): Top 0.035mm / dielectric 1.5mm / Bottom 0.035mm
Design rules "dirt_cheap_dirty_boards.v1.1": minimum track width 6mil, minimum drill 12mil, track to track 6mil, track to pad 6mil, pad to pad 6mil, via to via 6mil, smd to smd 0mil, copper to edge 10mil, drill to drill 10mil, minimum pad ring 10mil, minimum via ring 6mil, stop-mask expansion 2mil, vias tented up to drill 25mil, thermal gap 10mil

### Footprints (pad centres in the part's own frame; a part is rotated, then mirrored left to right if it is on the bottom)
PANASONIC_C = smd 2.6 x 1.4: + 2.05,0; - -2.05,0
PANASONIC_D = smd 3 x 1.4: + 2.4,0; - -2.4,0
PARTS_AMAN_RESISTOR_0603 = smd 1 x 1.1: 1 -0.85,0; 2 0.85,0
SOD123 = smd 1.4 x 1.4: A 1.9,0; C -1.9,0
SOT223 = smd 1.499 x 2.007: 1 -2.261,-3.15; 2 0.025,-3.15; 3 2.311,-3.15 | smd 3.81 x 2.007: 4 0,3.15
DBZ_R-PDSO-G3 = smd 0.7 x 1: 1 -0.95,-1.1; 2 0.95,-1.1; 3 0,1.1
MSOP-8 = smd 0.41 x 1.02: 1 -0.975,-2.4; 2 -0.325,-2.4; 3 0.325,-2.4; 4 0.975,-2.4; 5 0.975,2.4; 6 0.325,2.4; 7 -0.325,2.4; 8 -0.975,2.4
SO08 = smd 0.6 x 2.2: 1 -1.905,-2.6; 2 -0.635,-2.6; 3 0.635,-2.6; 4 1.905,-2.6; 5 1.905,2.6; 6 0.635,2.6; 7 -0.635,2.6; 8 -1.905,2.6
SO14 = smd 0.66 x 2.032: 1 -3.81,-3.073; 2 -2.54,-3.073; 3 -1.27,-3.073; 4 0,-3.073; 5 1.27,-3.073; 6 2.54,-3.073; 7 3.81,-3.073; 8 3.81,3.073; 9 2.54,3.073; 10 1.27,3.073; 11 0,3.073; 12 -1.27,3.073; 13 -2.54,3.073; 14 -3.81,3.073
WQP-PJ301M-12_JACK = drill 1.1: P$1 0,5; P$2 0,-3.5; P$3 0,-6.5
AVR_ICSP = drill 1.016 pad 1.88 octagon: 1 -1.27,5.08; 2 1.27,5.08; 3 -1.27,2.54; 4 1.27,2.54; 5 -1.27,0; 6 1.27,0; 7 -1.27,-2.54; 8 1.27,-2.54; 9 -1.27,-5.08; 10 1.27,-5.08
2X5-1.27 = drill 0.61 pad 1.067 octagon: 1 -1.27,3.81; 2 0,3.81; 3 -1.27,2.54; 4 0,2.54; 5 -1.27,1.27; 6 0,1.27; 7 -1.27,0; 8 0,0; 9 -1.27,-1.27; 10 0,-1.27
LED-BICOLOR-THROUGHHOLE = drill 0.7: 1 -2,0; 2 0,0; 3 2,0
INSTRUO_CRYSTAL_SMALLER = smd 0.4 x 2: GND 0,0; X1 -1.2,0; X2 1.2,0
SOT23-BEC = smd 1 x 1.4: B -0.95,-1.1; C 0,1.1; E 0.95,-1.1
ALPS_POT_VERTICAL_PS = drill 1 pad 1.88 square: P$1 -2.5,7; P$2 0,7; P$3 2.5,7 | drill 1.5 pad 2.54 octagon: P$4 -4.7,0; P$5 4.7,0
INSTRUO_Q-POT2 = drill 1 pad 1.5: P$1 -2.5,-7; P$2 0,-7; P$3 2.5,-7 | drill 2 pad 2.5: P$4 -4.4,0; P$5 4.4,0
RTRIM3296X = drill 0.61: 1 0,-2.54; 2 0,0; 3 0,2.54
R0805 = smd 1.3 x 1.5: 1 -0.95,0; 2 0.95,0
TACTILE-PTH = drill 1.016 pad 1.88: 1 -3.251,2.261; 2 3.251,2.261; 3 -3.251,-2.261; 4 3.251,-2.261
LQFP48 = smd 0.254 x 1: 1 -2.75,-4.25; 2 -2.25,-4.25; 3 -1.75,-4.25; 4 -1.25,-4.25; 5 -0.75,-4.25; 6 -0.25,-4.25; 7 0.25,-4.25; 8 0.75,-4.25; 9 1.25,-4.25; 10 1.75,-4.25; 11 2.25,-4.25; 12 2.75,-4.25; 25 2.75,4.25; 26 2.25,4.25; 27 1.75,4.25; 28 1.25,4.25; 29 0.75,4.25; 30 0.25,4.25; 31 -0.25,4.25; 32 -0.75,4.25; 33 -1.25,4.25; 34 -1.75,4.25; 35 -2.25,4.25; 36 -2.75,4.25 | smd 1 x 0.254: 13 4.25,-2.75; 14 4.25,-2.25; 15 4.25,-1.75; 16 4.25,-1.25; 17 4.25,-0.75; 18 4.25,-0.25; 19 4.25,0.25; 20 4.25,0.75; 21 4.25,1.25; 22 4.25,1.75; 23 4.25,2.25; 24 4.25,2.75; 37 -4.25,2.75; 38 -4.25,2.25; 39 -4.25,1.75; 40 -4.25,1.25; 41 -4.25,0.75; 42 -4.25,0.25; 43 -4.25,-0.25; 44 -4.25,-0.75; 45 -4.25,-1.25; 46 -4.25,-1.75; 47 -4.25,-2.25; 48 -4.25,-2.75

### Placement (x,y rotation side)
C1  20.67,51.29 0 bottom
C3  29,51 90 bottom
C4  16.5,74.5 180 bottom
C5  8.5,55 180 bottom
C6  12,55 0 bottom
C7  22.33,89.39 0 bottom
C8  5.35,50.29 0 bottom
C9  19.83,61.99 0 bottom
C10  36.5,78.5 90 bottom
C11  25.5,74.5 0 bottom
C12  16.48,76.89 180 bottom
C13  15.5,55 0 bottom
C14  21,74.5 180 bottom
C15  29.88,81.17 180 bottom
C16  14.92,80.51 90 bottom
C18  35.5,20 0 bottom
C19  28.32,14.01 0 bottom
C20  35.5,23 0 bottom
C21  34,37.5 0 bottom
C22  28.5,11.5 0 bottom
C23  37.5,37.5 0 bottom
C24  19,15 0 bottom
C25  19,12.5 0 bottom
C26  31.9,68.6 270 bottom
C27  4.41,23.25 0 bottom
C28  29.83,77.25 0 bottom
C29  8.5,41 0 bottom
C30  29.02,34 180 bottom
C31  12.5,96 180 bottom
C32  29,45 180 bottom
C33  14,21.7 270 bottom
C34  20.5,28.5 270 bottom
D1  36,51.8 180 bottom
D2  28,68 90 bottom
IC1  13,48.1 180 bottom
IC2  13.3,59.65 0 bottom
IC3  6,60 270 bottom
IC4  10.41,78.27 0 bottom
IC5  19.43,21.65 0 bottom
IC6  30.27,21.65 0 bottom
IC7  35.37,68.65 90 bottom
IC8  9.56,21.72 0 bottom
IC9  20.36,36.15 270 bottom
J1  5,49.5 0 top
J2  20,49.5 0 top
J3  35.2,49.5 0 top
J4  5,35.5 0 top
J5  5,21 0 top
J6  15.07,21 0 top
J7  25.13,21 0 top
J8  35.2,21 0 top
J9  35.2,35.5 0 top
J10  5,8 180 top
J11  15.07,8 180 top
J12  25.13,8 180 top
J13  35.2,8 180 top
JP1  32.78,60.79 90 bottom
JP2  2.19,90.95 0 bottom
LED1  13.29,105 0 top
LED2  20,105 0 top
LED3  26.71,105 0 top
Q1  27.5,87 45 bottom
Q2  34.8,6.8 0 bottom
Q3  28.4,6.8 0 bottom
Q4  25,6.8 0 bottom
Q5  15.3,6.8 0 bottom
Q6  5.5,6.8 0 bottom
R1  2.79,86.83 180 bottom
R2  11.5,102 90 bottom
R3  14.9,102 90 bottom
R4  18.3,102 90 bottom
R5  12,91 180 top
R6  32.5,91 180 top
R7  21.7,102 90 bottom
R8  16,88 0 bottom
R9  25.1,102 90 bottom
R10  28.5,102 90 bottom
R11  2.85,97.83 180 bottom
R12  24.8,55.17 0 bottom
R13  32,14 0 bottom
R14  34,35 0 bottom
R15  32,11.5 180 bottom
R16  37.5,35 0 bottom
R17  6.5,72.5 0 top
R18  20,65 0 top
R19  33.5,72.5 0 top
R20  20.09,1.95 0 bottom
R21  23.67,22.09 270 bottom
R22  32,2 0 bottom
R23  28.8,2 0 bottom
R24  8.5,38.5 0 bottom
R25  8.5,35.75 180 bottom
R26  8.5,33 180 bottom
R27  33.5,72.6 270 bottom
R28  12.5,41 0 bottom
R29  12.5,38.5 180 bottom
R30  12.5,36 180 bottom
R31  12.5,33.5 180 bottom
R32  12.5,31 180 bottom
R33  16.79,28.75 0 bottom
R34  8.5,15.5 0 bottom
R35  4.37,20.59 0 bottom
R36  8.5,13.09 180 bottom
R37  12.5,93.33 0 bottom
R38  12.5,88 0 bottom
R39  12.5,90.67 0 bottom
R40  29,42.25 0 bottom
R41  29,39.5 180 bottom
R42  29,36.75 180 bottom
R43  29,31.25 180 bottom
R44  29,28.5 180 bottom
R45  23,28.5 90 bottom
R46  12.22,27.59 0 bottom
R47  20.5,66.5 0 bottom
R48  20.5,69 0 bottom
R49  20.5,71.5 0 bottom
R50  11.72,6.5 90 bottom
R51  9.14,6.5 270 bottom
R52  2.26,6.5 90 bottom
R53  8.48,10.67 180 bottom
R54  32,6.5 270 bottom
R55  38.39,6.5 270 bottom
R56  22,6.5 270 bottom
R57  19,6.5 270 bottom
R58  8.43,2.83 0 bottom
R59  22.72,95.99 90 bottom
R60  2.62,55.17 270 bottom
S1  5,105 0 top
S2  35,105 0 top
UC1  22.28,81.99 225 bottom

### Tracks (layer width: path | path; a pad name or v marks a point on that pad's centre or on a via)
+3V3  (via drill 0.3)
  Top 0.152: v3.62,96.25 3.5,96.12 3.5,94.88 JP2.1 | v13.75,54.12 13,54.88 13,59 12.88,59.12 v12.88,69.88
  Bottom 0.152: 12.88,52.5 12.88,51.25 13,51.25 IC1.2 | 12.88,52.5 12.88,54.12 | 12.88,54.12 12.88,55 C6.1 | 12.88,52.5 17.38,52.5 18.5,51.38 C1.+ | v3.62,96.25 3.62,96.88 | 3.62,96.88 3.62,97.75 R11.2 | 23.25,87 22.88,87 | 22.88,87 21.25,87 UC1.48 | 23.25,87 UC1.1 23.25,87 | 23.25,87 23.25,89.38 C7.1 23.12,89.5 15.75,96.88 3.62,96.88 | 22.88,76.62 21.62,75.38 21.12,75.38 20.25,74.5 C14.1 20.12,74.5 19.25,73.62 16.62,73.62 | 22.88,76.62 23.25,77 UC1.24 | 19.25,81.25 17.62,81.25 17.38,81 UC1.36 | 19.25,81.25 21.62,78.88 21.62,77.75 21.75,77.75 22.88,76.62 | 16.62,73.62 15.75,74.5 C4.1 | 22.88,87 22.88,86.38 23.12,86.12 23.12,81.25 19.25,81.25 | v13.75,54.12 12.88,54.12 | 16.62,73.62 v12.88,69.88
+3V3_A  (via drill 0.3)
  Top 0.152: v21.5,33.38 19.75,31.62 19.75,29 19.38,28.62 v14.88,28.62 | v25,54.12 v25,34.5
  Bottom 0.152: 22.38,34.25 25,34.25 | 25,34.25 27.88,34.25 28.12,34 C30.1 | 22.38,34.25 22.12,34.5 22.12,36.12 23.38,36.12 IC9.4 | C33.1 14,22.62 12.38,24.25 11.5,24.25 IC8.8 11.38,24.38 11.38,27.5 R46.2 11.38,27.62 12.12,28.38 14.62,28.38 v14.88,28.62 | v21.5,33.38 22.38,34.25 | 11.75,76.12 12.5,76.88 14.88,76.88 | 11.75,76.12 11.5,75.88 IC4.1 | 14.88,76.88 15.62,76.88 C12.1 | 14.88,76.88 14.88,79.62 C16.1 | 19.75,69 19.75,68.62 | 19.75,68.62 19.75,66.5 R47.2 | 19.75,69 R48.2 | 19.75,69 19.75,71.5 | 19.75,71.5 R49.2 19.75,71.5 | 19.75,69 R48.2 | 19.75,71.5 21,72.75 26.25,72.75 26.25,74.5 C11.1 | 11.75,76.12 11.25,76.62 9.12,76.62 8.5,76 8.5,68.62 | 19.75,68.62 8.5,68.62 | 19.75,68.62 R48.2 | UC1.9 26.12,84 25.75,83.62 25.75,81.75 28.5,81.75 29,81.25 C15.1 29.12,81.12 31.12,79.12 37.25,79.12 | 37.25,79.12 37.5,79.38 37.5,84 R6.P$1 | 1.62,57.75 1.62,55.38 1.88,55.12 3.38,55.12 3.88,55.62 7,55.62 7.62,55 C5.1 | 1.62,57.75 7,57.75 9.12,59.88 IC3.2 9.25,60 11.12,61.88 17.75,61.88 C9.+ 17.88,61.88 19.25,61.88 20.25,60.88 31.5,60.88 | 31.5,60.88 31.5,59.12 30.62,58.25 28.75,58.25 25.75,55.25 R12.1 25.62,55.12 25,55.12 v25,54.12 | 37.25,79.12 37.25,77.88 39.75,75.38 39.75,60.88 31.5,60.88 | 8.5,68.62 7,67.12 4.12,67.12 1.5,64.5 1.5,57.75 1.62,57.75 | v25,34.5 25,34.25
AREF_2.5  (via drill 0.3)
  Top 0.152: v11,74.88 13.5,72.38 v13.5,59.38
  Bottom 0.152: 16.25,55.62 16.25,55 C13.1 | 16.25,55.62 16.25,56.5 14.25,58.5 IC2.1 14.25,58.62 v13.5,59.38 | v11,74.88 10.75,74.88 10.75,75.75 IC4.2 | 16.25,55.62 23.5,55.62 23.88,55.25 R12.2
AREF_-10  (via drill 0.3)
  Top 0.152: R19.P$1 31,77.5 25.75,82.75 25.75,95.5 25.38,95.88 R59.3 | v17.5,64.12 R18.P$1 | R5.P$3 8.5,83 v8.5,66.75 | v1,30.88 1.25,31.12 1.25,62.75 R17.P$1
  Bottom 0.152: R59.2 22.75,96 R59.3 | 33.5,69.5 32,69.5 C26.1 | 33.5,69.5 34.25,69.5 IC7.2 34.38,69.5 37,66.88 37,64.5 35.5,64.5 34.5,65.5 34.5,66.5 33,66.5 32,65.5 R19.P$1 29.38,67.12 23.38,67.12 21.88,65.62 17.5,65.62 | 33.5,69.5 R27.2 | 1.75,30.12 1.75,22.38 3.5,20.62 R35.2 | 1.75,30.12 14.62,30.12 14.88,30.38 26.62,30.38 26.88,30.12 28.62,30.12 29.75,31.25 R43.2 | 17.5,65.62 17.5,66.75 v8.5,66.75 5.25,66.75 R17.P$1 | 17.5,65.62 v17.5,64.12 | v1,30.88 1.75,30.12
ASYM_ADC  (via drill 0.3)
  Top 0.152: v26.38,78.25 26.62,78 26.62,63.25 25.88,62.5 25.88,47 25.62,46.75 v25.62,40.88
  Bottom 0.152: C29.2 7.75,41 8.62,41.88 12.38,41.88 13.25,41 R28.1 13.38,41 14.38,40 17.25,40 IC9.14 17.38,40 18,40.62 25.38,40.62 v25.62,40.88 | v26.38,78.25 25.5,79.12 UC1.18
ATTENUVERTER_ADC  (via drill 0.3)
  Top 0.152: v30.12,82.5 32.5,82.5 R6.P$2
  Bottom 0.152: v30.12,82.5 27.75,82.5 27.25,83 UC1.12
BI  (via drill 0.3)
  Top 0.152: v18.25,69.25 18.75,68.75 18.75,52.75 v18.62,52.62 | v30.25,14.88 v30.25,50.38
  Bottom 0.152: v18.25,69.25 12.25,69.25 12.25,70.12 12.62,70.5 12.75,70.5 12.75,73.12 11.62,74.25 10.12,74.25 10.12,75.75 IC4.3 | v18.62,52.62 19,52.25 27.62,52.25 29.5,50.38 v30.25,50.38 | v30.25,14.88 31.12,14 R13.2
BI_OUT  (via drill 0.3)
  Top 0.152: v29.62,4.12 28.12,5.62 28.12,13.62 25.38,16.38 22.75,16.38 v22.75,17.88
  Bottom 0.152: R22.2 31.12,2 29.75,2 R23.1 29.62,2 v29.62,4.12 | v22.75,17.88 21.62,19 21.38,19 IC5.1
BOOT_FLASH
  Bottom 0.152: UC1.44 19.75,85.62 19.5,85.88 15.62,85.88 15.38,85.62 14.5,85.62 14,86.12 4.38,86.12 3.75,86.75 R1.2
CLOCK  (via drill 0.3)
  Top 0.152: v25.25,77.38 25,77.12 25,71.5 v23.12,69.62 | v31.12,9.75 34.75,13.38 38.5,13.38 38.5,54.62 34,59.12 34,63.5 32,65.5 v32,66.38
  Bottom 0.152: v25.25,77.38 25.12,77.38 24.5,78 UC1.21 | R48.1 21.38,69 22.5,69 v23.12,69.62 23.88,68.88 28.12,68.88 30,67 31.38,67 v32,66.38 | v31.12,9.75 30.25,9.75 28.5,8 Q3.C
CYCLE_SW  (via drill 0.3)
  Top 0.152: v27.25,84.5 26.12,85.62 26.12,99.12 22.62,102.62 8.38,102.62 S1.4
  Bottom 0.152: v27.25,84.5 26.62,83.88 UC1.10 | S1.3 S1.4
DAC_MOSI  (via drill 0.3)
  Top 0.152: v12.75,78.62 v15.5,78.62
  Bottom 0.152: v15.5,78.62 17.25,78.62 18.12,77.75 19.88,77.75 20.12,78 UC1.28 | v12.75,78.62 11.5,79.88 11.12,79.88 10.75,80.25 10.75,80.62 IC4.7
DAC_SCK  (via drill 0.3)
  Top 0.152: v18.38,75 18.25,74.88 v18.25,72.75 | v17,72.75 12.25,77.5 v12.25,78
  Bottom 0.152: v18.38,75 20.75,77.38 UC1.26 | v17,72.75 v18.25,72.75 | v12.25,78 10.12,80.12 10.12,80.62 IC4.6
DAC_SS  (via drill 0.3)
  Top 0.152: v20.62,75.88 20.38,75.62 v20.38,73.38 | v16.5,72.12 11.38,77.25 v11.38,77.88
  Bottom 0.152: v20.62,75.88 21.12,75.88 21.12,77 UC1.25 | v20.38,73.38 19.38,72.38 18.75,72.38 18.5,72.12 v16.5,72.12 | v11.38,77.88 9.5,79.75 9.5,80.62 IC4.5
EOA_OUT  (via drill 0.3)
  Top 0.152: v18,78.75 17.62,78.38 17.62,64.88 18.12,64.38 v18.12,59.25 | v24.62,56.25 24.38,56 24.38,32.38 22.5,30.5 22.5,26 19.38,22.88 19.38,11.88 19.12,11.62 19.12,8.62 v19.38,8.38
  Bottom 0.152: v18,78.75 18,79.38 18.38,79.75 UC1.33 | v18.12,59.25 18.38,59 20.5,59 21.5,58 21.5,56.25 v24.62,56.25 | v19.38,8.38 19.38,7.38 19,7.38 R57.1
EOD_OUT  (via drill 0.3)
  Top 0.152: v19.75,60.5 v19.75,79.88 | v16.88,59.88 15.12,58.12 v15.12,56.75 | v12,56.5 11.38,55.88 v11.38,4.62
  Bottom 0.152: v19.75,79.88 19,79.88 18.75,79.62 UC1.32 | v19.75,60.5 19.12,59.88 v16.88,59.88 | v15.12,56.75 14.88,56.5 v12,56.5 | v11.38,4.62 9.62,2.88 9.38,2.88 R58.1
F_CV  (via drill 0.3)
  Top 0.152: v20.75,22.62 20.5,22.38 v20.5,20.62 20.5,4.5 v20.88,4.12
  Bottom 0.152: R23.2 27.88,2 27.75,1.88 21,1.88 R20.1 20.88,2 v20.88,4.12 | v20.75,22.62 23.38,22.62 23.62,22.88 R21.1 | v20.5,20.62 20.5,19.12 20.12,19.12 IC5.2
FM_ADC  (via drill 0.3)
  Top 0.152: v22.25,78.25 21.25,77.25 v21.25,65 | v16.88,63.25 14.5,60.88 v14.5,35.75 | v10.75,25.88 v10.75,34.88 | v10.25,22.75 v10.25,16.38
  Bottom 0.152: v22.25,78.25 25,81 26.5,81 26.88,80.62 UC1.14 | v21.25,65 19.5,63.25 v16.88,63.25 | v14.5,35.75 13.62,34.88 v10.75,34.88 | v10.25,16.38 9.38,15.5 R34.1 | v10.25,22.75 10.25,24.25 IC8.7 10.25,24.38 10.75,24.38 v10.75,25.88 10.5,26.12 6.62,26.12 5.38,24.88 5.25,24.88 3.62,23.25 C27.2
FREEZE  (via drill 0.3)
  Top 0.152: v22.75,72.12 22.75,77.88 v24.38,79.5 24.38,80.88 26.75,80.88 v28.88,78.75 | v39.12,13.88 39.75,14.5 39.75,74.88 v36.5,78.12
  Bottom 0.152: v24.38,79.5 25,78.88 UC1.19 | v22.75,72.12 22.12,71.5 21.38,71.5 R49.1 | v39.12,13.88 35.62,10.38 30.38,10.38 30,10 27,10 25,8 Q4.C | v36.5,78.12 35.88,78.75 v28.88,78.75
GND  (via drill 0.3)
  Top 0.152: J5.P$3 J5.P$2 2,17.5 2,26 J4.P$3 J4.P$2 | R17.P$3 9.25,65.25 v9.25,50.38 9.25,47.25 J1.P$3 | v17,78 v17,79.88 v17,86.88 | JP2.9 3.5,89.75 4.25,90.5 4.25,91.38 3.5,92.12 JP2.5 3.5,92.25 3.5,93.38 JP2.3 3.5,93.5 4.25,94.25 4.25,107.25 | 33,107.25 S2.1 | 33,107.25 S2.2 | 4.25,107.25 S1.2 | 4.25,107.25 S1.1 | 35.5,65 35.38,64.88 35.38,62.12 JP1.4 | 35.5,65 R19.P$3 35.5,65 | JP1.6 32.75,62 32.75,59.62 JP1.5 32.75,59.5 30.25,59.5 JP1.7 30.25,59.62 30.25,62 JP1.8 | v22,73.38 22,58.5 R18.P$3 | 35.5,65 35.5,73.5 29.5,79.5 29.5,83.5 R6.P$3 33,87 33,107.25 | v34.25,24.12 34.12,24.25 34.12,28 35.12,29 J9.P$3 35.25,29 35.25,32 J9.P$2 | 15.12,14.5 J6.P$3 15.12,14.5 | 35.25,14.5 J13.P$3 35.25,14.5 | J12.P$3
  Bottom 0.152: 14,20.5 14,14.5 15,14.5 J6.P$3 15.12,14.5 15.5,14.12 19.88,14.12 | 14,20.5 14,20.75 C33.2 | 14,20.5 18.75,20.5 18.75,19.12 IC5.3 | 14,20.5 C33.2 | 19.88,14.5 19.88,15 C24.1 19.88,14.5 | 19.88,14.5 19.88,14.12 | 19.88,14.12 19.88,12.5 C25.1 | 26.75,12.38 25.25,13.88 25.25,14.5 J12.P$3 19.88,14.5 | 26.75,12.38 27.62,11.5 C22.2 | 26.75,12.38 33,12.38 35.12,14.5 J13.P$3 | R50.1 11.75,5.62 14.25,5.62 Q5.E 14.38,5.62 15.25,4.75 16.12,4.75 | 25,4.75 24.12,5.62 Q4.E | 26.62,4.75 25,4.75 | 26.62,4.75 27.5,5.62 Q3.E | 26.62,4.75 32.88,4.75 33.75,5.62 Q2.E | 25,4.75 16.12,4.75 | 9,20.88 9,19.12 IC8.3 8.88,19.12 7.75,19.12 IC8.4 7.62,19 6.12,17.5 J5.P$2 | 9,20.88 9,22.12 9.38,22.5 9.5,22.5 9.5,25.5 9.25,25.75 7.75,25.75 7.75,24.38 IC8.5 | 3.5,5.62 4.5,5.62 Q6.E | 3.5,5.62 2.38,5.62 R52.1 2.25,5.75 1.38,6.62 1.38,14.5 J5.P$3 | 16.12,4.75 16.12,1.25 4.75,1.25 3.5,2.5 3.5,5.62 | 9,20.88 14,20.88 C33.2 | C8.- 7.5,50.38 v9.25,50.38 9.88,50.38 10.62,51.12 IC1.1 10.75,55.38 | 10.25,55.88 9.38,55 C5.2 | 10.25,55.88 11.5,57.12 12.25,57.12 12.25,58.5 IC2.2 | 10.25,55.88 10.75,55.38 | 10.75,55.38 11.12,55 C6.2 10.75,55.38 | 10.25,55.88 13.75,55.88 14.62,55 C13.2 | R17.P$3 9.12,65.5 9.12,62.38 IC3.1 | 7.62,33 6.62,32 J4.P$2 | 7.62,33 R26.1 7.62,33 | 5.75,42.25 6.88,41.12 6.88,33 7.62,33 | 5.75,42.25 J1.P$3 | 5.75,42.25 19.25,42.25 J2.P$3 21.5,41.5 25.88,41.5 26.25,41.12 26.25,39.25 22.25,39.25 20.5,37.5 | C4.2 17.38,74.5 17.38,76.88 C12.2 17.25,77 17.25,78 v17,78 | 17,80.25 16.25,80.25 15.25,81.25 15,81.25 C16.2 14.88,81.25 12,81.25 11.5,80.75 IC4.8 | 17,80.25 17.38,80.25 17.62,80.5 UC1.35 | 17,80.25 v17,79.88
  Bottom 0.152: 19.62,87.75 19.38,88 17,88 | 19.62,87.75 20.75,86.62 UC1.47 | 17,88 16.88,88 R8.1 | 19.62,87.75 19.75,87.75 21.38,89.38 C7.2 | 2.62,88.88 2,88.88 2,86.88 R1.1 | 2.62,88.88 3.38,89.62 JP2.9 | 2.62,88.88 15.88,88.88 16.75,88 R8.1 | 17,88 v17,86.88 | 17,88 R8.1 | S2.1 31.62,107.25 29,107.25 26.75,105 LED3.2 26.62,105 25.75,105.88 19.12,105.88 | 12.38,105.88 11,107.25 8.38,107.25 S1.2 | 12.38,105.88 13.25,105 LED1.2 | 19.12,105.88 LED2.2 | 12.38,105.88 19.12,105.88 | 27,85.62 27.5,86.12 Q1.GND | 27,85.62 25.88,84.5 UC1.8 | 27,85.62 28.62,84 R6.P$3 30.75,84 30.75,81.25 C15.2 30.75,81.12 36.38,81.12 36.5,81 C10.+ | JP1.5 32.88,59.5 35.25,59.5 JP1.3 35.38,59.5 35.88,59 36.5,59 36.88,58.62 36.88,43 35.25,43 J3.P$3 35.12,43 34.12,43 | C26.2 32,67.75 34.25,67.75 IC7.1 34.38,67.62 36,66 R19.P$3 | JP1.6 32.88,62.12 35.25,62.12 JP1.4 | C9.- 22,62 25.88,62 27.12,63.25 29,63.25 30.12,62.12 JP1.8 | 24.62,74.5 24.62,76.5 23.75,77.38 UC1.23 23.62,77.5 23.5,77.62 23.38,77.62 23.38,78.12 24.12,78.88 24.38,78.88 24.75,78.5 UC1.20 | 24.62,74.5 C11.2 24.62,74.5 | 24.62,74.5 22,74.5 | 22,74.5 21.88,74.5 C14.2 22,74.5 | R18.P$3 22.75,58.25 28.25,58.25 29.5,59.5 30.12,59.5 JP1.7 | v22,73.38 22,74.5 | 35,39.12 34.12,40 34.12,43 | 35,39.12 36.62,37.5 C23.2 | C1.- 22.75,51.25 23.38,50.62 27.5,50.62 29,49.12 29,48.62 C3.- 29,48.5 29,47.88 33.75,43.12 34,43.12 34.12,43 | C18.2 34.75,20 34.75,23 C20.2 34.62,23 34.62,24.12 v34.25,24.12 | IC9.10 17.38,35 17.38,36.12 IC9.11 17.38,36.25 17.38,37.38 IC9.12 17.38,37.5 20.5,37.5 | 26.25,35.12 23.62,35.12 23.5,35 IC9.5 | 26.25,35.12 28.62,35.12 29.75,34 C30.2 | 26.25,35.12 24.62,36.75 24.12,36.75 23.5,37.38 IC9.3 23.38,37.5 20.5,37.5
  Bottom 0.152: C30.2 29.88,33.25 30.62,32.5 34.62,32.5 35.12,32 J9.P$2 | C30.2 | 35,39.12 34,38.12 34,34 C30.2 | C30.2
  pour Top (isolate 0.012): 0,109 40,109 40,0 0,0
  pour Bottom: 0,109 40,109 40,0 0,0
JTCK
  Bottom 0.152: UC1.37 17.25,83 16.62,82.38 4.5,82.38 0.75,86.12 0.75,93.38 2.12,93.38 JP2.4
JTDI
  Bottom 0.152: UC1.38 17.62,83.5 17.38,83.75 16.5,83.75 15.5,82.75 4.62,82.75 1.12,86.25 1.12,90.88 2.12,90.88 JP2.8
JTDO  (via drill 0.3)
  Top 0.152: v16.38,84.62 15.75,85.25 15.75,89.75 14.25,91.25 14.25,101 13.88,101.38 4.88,101.38 4.88,89.88 3.88,88.88 0.38,88.88 0.38,97.12 0.75,97.5 1.62,97.5 1.62,95.38 1.38,95.12 1.38,93 2.12,92.25 JP2.6
  Bottom 0.152: v16.38,84.62 17.25,84.62 18,83.88 UC1.39
JTMS  (via drill 0.3)
  Top 0.152: v12.38,80.62 10.75,82.25 10.75,89.75 v10,90.5
  Bottom 0.152: v12.38,80.62 15.38,80.62 16.75,79.25 17.62,79.25 17.62,79.75 18,80.12 UC1.34 | v10,90.5 4.88,95.62 3,95.62 2.25,94.88 JP2.2
LEVEL_ADC  (via drill 0.3)
  Top 0.152: v25.12,80.25 25.75,79.62 25.75,77.75 26.25,77.25 26.25,63.75 25.25,62.75 v25.25,57.38 | v26.88,57.25 26.62,57 26.62,47 26.88,46.75 26.88,34.38 v25,32.5 24.5,32 24.5,28.25 v24.12,27.88
  Bottom 0.152: C34.2 20.5,27.62 23,27.62 R45.1 23,27.75 23.12,27.88 v24.12,27.88 | v25.12,80.25 25.75,80.25 26.12,79.88 UC1.16 | v25.25,57.38 25.38,57.25 v26.88,57.25 | v25,32.5 24.88,32.38 23.5,32.38 IC9.7
N$1  (via drill 0.3)
  Top 0.152: v29,38.62 27.5,40.12 v27.5,40.62
  Bottom 0.152: v29,38.62 29.75,38.62 29.75,36.75 R42.2 | v27.5,40.62 23.25,44.88 16.38,44.88 13.5,47.75 3.5,47.75 1.75,49.5 1.75,52.12 2.75,52.12 5,54.38 J1.P$1
N$2
  Bottom 0.152: 28.25,39.5 28.25,38.75 | 28.25,38.75 28.25,36.75 R42.1 | 28.25,39.5 R41.1 28.25,39.5 | 28.25,42.25 28.25,45 C32.1 | 28.25,42.25 R40.2 28.25,42.25 | 28.25,42.25 28.25,39.5 | 28.25,38.75 23.5,38.75 IC9.2
N$3  (via drill 0.3)
  Top 0.152: v8.62,48.38 8.75,48.5 8.75,50 8.38,50.38 8.38,63.62 R17.P$2
  Bottom 0.152: v8.62,48.38 19.12,48.38 21.62,45.88 29,45.88 29,41.62 29.25,41.38 29.75,41.38 29.75,39.5 R41.2
N$4  (via drill 0.3)
  Top 0.152: v15.75,38.75 16.25,39.25 16.25,52 v18.12,53.88
  Bottom 0.152: v15.75,38.75 13.62,38.75 13.38,38.5 R29.2 | v18.12,53.88 18.75,54.5 J2.P$1
N$5
  Bottom 0.152: C29.1 9.38,41 11.62,41 R28.2 11.75,41 11.75,39.38 | 11.75,38.5 11.75,36 R30.1 | 11.75,38.5 R29.1 11.75,38.5 | 11.75,38.5 11.75,39.38 | 11.75,39.38 16.62,39.38 17.25,38.75 IC9.13
N$6  (via drill 0.3)
  Top 0.152: v15.25,27.38 18.12,24.5 v18.12,17
  Bottom 0.152: v15.25,27.38 13.25,27.38 13.12,27.5 R46.1 | v18.12,17 18.38,17.25 24.88,17.25 J7.P$2
N$7
  Bottom 0.152: UC1.6 25.12,85.25 26.62,86.75 26.62,87.75 Q1.X2
N$8
  Bottom 0.152: UC1.5 24.88,85.62 25.5,86.25 25.5,89 27.25,89 28.62,87.62 28.62,86.25 28.38,86.25 Q1.X1
N$9  (via drill 0.3)
  Top 0.152: v15.38,38 15.12,38.25 15.12,53.25 v18.12,56.25
  Bottom 0.152: v15.38,38 13.38,36 R30.2 | v18.12,56.25 19.88,58 R18.P$2
N$10  (via drill 0.3)
  Top 0.152: v14.38,31.62 15.12,32.38 15.12,35.5 16.88,37.25 v16.88,49.38 | v27.25,50 29.25,52 29.25,52.62 v31.12,54.5
  Bottom 0.152: v14.38,31.62 14,31.62 13.38,31 R32.2 | v16.88,49.38 17.5,50 v27.25,50 | v31.12,54.5 35.12,54.5 J3.P$1
N$11  (via drill 0.3)
  Top 0.152: 15.25,29.88 15.75,30.38 v15.75,32.5 | 15.25,29.88 v15,29.62 14.25,28.88 14.25,28 21.62,28 22.12,28.5 22.12,30.62 24,32.5 24,57 24.88,57.88 24.88,63.25 23.62,63.25 22.62,64.25 22.62,65.75 25.38,68.5 25.38,75.62 v25.62,75.88 | 15.25,29.88 v13,32.12
  Bottom 0.152: 11.75,32.12 11.75,33.5 R31.1 | 11.75,32.12 11.75,31 R32.1 | v15,29.62 15.88,28.75 R33.2 | v15.75,32.5 16.75,33.5 17.25,33.5 IC9.9 | v25.62,75.88 29.25,75.88 30.62,77.25 C28.1 | v13,32.12 11.75,32.12
N$12  (via drill 0.3)
  Top 0.152: v19.88,33.25 21.12,34.5 21.12,44.38 23.62,46.88 23.62,62 v24.25,62.62
  Bottom 0.152: v19.88,33.25 17.5,30.88 16,30.88 13.38,33.5 R31.2 | v24.25,62.62 24.88,63.25 26.62,63.25 27.62,64.25 32.25,64.25 R19.P$2
N$13
  Bottom 0.152: R44.2 29.88,28.5 31.25,27.12 34,27.12 35.12,26 J8.P$1
N$14
  Bottom 0.152: IC9.6 23.5,33.5 25.88,33.5 28.12,31.25 R43.1 28.25,31.25 29.12,32.12 30.38,32.12 30.62,31.88 30.62,29.75 28.88,29.75 27.88,28.75 | C34.1 20.5,29.38 23,29.38 R45.2 23,29.25 27.38,29.25 27.88,28.75 | 27.88,28.75 28.12,28.5 R44.1 27.88,28.75
N$15  (via drill 0.3)
  Top 0.152: v10.12,89.5 5.88,85.25 v5.88,69.38 | v12,47.12 12.38,46.75 12.38,28.62 15,26 J6.P$1
  Bottom 0.152: v10.12,89.5 10.5,89.5 11.62,90.62 R39.2 | v5.88,69.38 1.12,64.62 1.12,47.12 v12,47.12
N$16  (via drill 0.3)
  Top 0.152: v14.25,89.75 v14.25,87.12 | v9.62,17.62 9,18.25 v9,31.88 | v8.75,34.62 8.75,46.25 10.88,48.38 10.88,70 9.12,71.75 9.12,76.5 13.25,80.62 13.25,85.12 13,85.38 v13,86.88
  Bottom 0.152: C31.1 11.75,95.88 11.75,93.38 R37.2 11.75,93.25 13.5,91.5 13.5,90.75 13.38,90.75 R39.1 13.38,90.62 v14.25,89.75 | v14.25,87.12 13.75,87.62 | 13.75,87.62 13.38,88 R38.1 13.75,87.62 | v9.62,17.62 10.12,17.62 10.12,19 IC8.2 | v9,31.88 8.5,32.38 8.5,33.62 8.75,33.88 v8.75,34.62 | 13.75,87.62 v13,86.88
N$17  (via drill 0.3)
  Top 0.152: v11.75,86.75 12,86.5 R5.P$2
  Bottom 0.152: v11.75,86.75 11.75,88 R38.2
N$18
  Bottom 0.152: R22.1 32.88,2 33.88,3 35.12,3 J13.P$1
N$19  (via drill 0.3)
  Top 0.152: v15.12,86.25 14.5,85.62 R5.P$1
  Bottom 0.152: v15.12,86.25 15.12,88 R8.2
N$20  (via drill 0.3)
  Top 0.152: v19.75,11.38 19.88,11.5 19.88,22.88 23,26 J7.P$1
  Bottom 0.152: v19.75,11.38 17.88,11.38 16.62,12.62 9.75,12.62 9.38,13 R36.2
N$21  (via drill 0.3)
  Top 0.152: v10.25,9.75 8,12 8,23.75 6.88,24.88 5,24.88 J5.P$1
  Bottom 0.152: v10.25,9.75 19.62,9.75 22,7.38 R56.1
N$22
  Bottom 0.152: R36.1 7.75,13.12 7.75,15.5 R34.2 7.62,15.5 6.75,16.38 4.62,16.38 3.88,17.12 3.88,19.75 4.38,19.75 5.12,20.5 R35.1 5.25,20.62 5.25,22.88 | 5.25,22.88 C27.1 5.25,22.88 | 5.25,22.88 8.88,22.88 8.88,24.25 IC8.6
N$23
  Bottom 0.152: R56.2 22,5.75 23,6.75 24.88,6.75 25.88,5.75 Q4.B
N$24
  Bottom 0.152: R54.1 32,7.38 34.62,10 36.12,10 39.75,13.62 39.75,40.5 35.25,40.5 J9.P$1
N$25
  Bottom 0.152: R54.2 32,5.62 29.38,5.62 Q3.B
N$26
  Bottom 0.152: R58.2 7.5,2.88 7.5,5.62 6.5,5.62 Q6.B
N$27
  Bottom 0.152: 5.38,7.88 5.5,7.88 Q6.C 5.38,7.88 | 5.38,7.88 4.88,7.88 | 4.88,7.88 2.88,7.88 2.38,7.38 R52.2 | 4.88,7.88 7.62,10.62 R53.1 | 5.38,7.88 5.38,5 5.12,4.75 3.88,4.75 3.88,2.62 4.88,1.62 13.62,1.62 15,3 J11.P$1
N$28
  Bottom 0.152: R10.2 28.5,102.88 28.5,105 28.62,105 LED3.3
N$29
  Bottom 0.152: R9.2 25,102.88 25,105 24.75,105 LED3.1
N$30
  Bottom 0.152: LED2.3 21.75,105 21.75,102.88 R7.2
N$31
  Bottom 0.152: LED2.1 18.25,105 18.25,102.88 R4.2
N$32
  Bottom 0.152: R3.2 15,102.88 15,105 15.25,105 LED1.3
N$33
  Bottom 0.152: R2.2 11.5,102.88 11.5,105 11.38,105 LED1.1
N$34  (via drill 0.3)
  Top 0.152: v22.5,85.88 23.62,87 v23.62,96.62
  Bottom 0.152: v22.5,85.88 20.88,85.88 20.62,86.12 UC1.46 | v23.62,96.62 28.12,101.12 28.5,101.12 R10.1
N$35  (via drill 0.3)
  Top 0.152: v22,85.25 21.88,85.38 21.88,98 v24.12,100.25
  Bottom 0.152: v22,85.25 21.88,85.38 20.75,85.38 20.25,85.88 UC1.45 | v24.12,100.25 25,101.12 R9.1
N$36  (via drill 0.3)
  Top 0.152: v21.38,100.12 v21.38,84.75
  Bottom 0.152: v21.38,84.75 19.88,84.75 19.5,85.12 UC1.43 | v21.38,100.12 21.38,101.12 21.62,101.12 R7.1
N$37  (via drill 0.3)
  Top 0.152: v19.88,84.12 19.25,84.75 v19.25,100.25
  Bottom 0.152: v19.88,84.12 19.75,84.12 19.12,84.75 UC1.42 | v19.25,100.25 18.38,101.12 R4.1
N$38  (via drill 0.3)
  Top 0.152: v13.75,85.5 13.62,85.62 v13.62,100.75
  Bottom 0.152: v13.75,85.5 14,85.25 17.88,85.25 18.62,84.5 UC1.41 | v13.62,100.75 14,101.12 14.88,101.12 R3.1
N$39  (via drill 0.3)
  Top 0.152: v19.25,83.5 18.25,84.5 v18.25,96.88
  Bottom 0.152: v19.25,83.5 19,83.5 18.5,84 UC1.40 | v18.25,96.88 15,100.12 12.5,100.12 11.5,101.12 R2.1
N$40  (via drill 0.3)
  Top 0.152: v27.5,24.88 29.62,27 29.62,52.12 v33.62,56.12 | v36.25,58.38 36.62,58.75 36.62,64.62 37,65 37,70.88 35.88,72 35.88,80.88 33.75,83 v33.75,87.25
  Bottom 0.152: v27.5,24.88 27.38,24.88 23.75,21.25 R21.2 | v33.62,56.12 35.88,58.38 v36.25,58.38 | v33.75,87.25 25.88,95.12 21,95.12 20.25,95.88 R59.1
N$41  (via drill 0.3)
  Top 0.152: v25.12,31 26.5,29.62 26.5,25 27.5,24 29.62,24 v29.62,20.62
  Bottom 0.152: 9.38,34.25 9.38,35.75 R25.2 | 9.38,34.25 9.38,33 R26.2 | 9.38,34.25 11,34.25 11.12,34.38 16,34.38 16.12,34.25 19.75,34.25 23,31 v25.12,31 | v29.62,20.62 29.75,20.5 30,20.5 30.88,19.62 30.88,19.12 IC6.2
N$42  (via drill 0.3)
  Top 0.152: v26.5,13.5 26.5,13.38 24.75,13.38 22.25,10.88 22.25,3 v20.25,3 18.75,4.5 v18.75,22.62
  Bottom 0.152: IC5.7 20,24.25 18.88,24.25 IC5.6 18.75,24.25 v18.75,22.62 | v20.25,3 19.25,2 R20.2 | v26.5,13.5 27,14 27.38,14 C19.2
N$43  (via drill 0.3)
  Top 0.152: v21.25,13.88 21.12,14 v21.12,21.88
  Bottom 0.152: R15.1 31.12,11.5 29.38,11.5 C22.1 29.25,11.5 28.12,10.38 24.75,10.38 v21.25,13.88 | v21.12,21.88 21,22 18.5,22 17.62,22.88 17.62,24.25 IC5.5
N$44
  Bottom 0.152: Q5.C 15.25,7.88 14.75,7.38 11.75,7.38 R50.2 11.62,7.38 9.25,7.38 R51.1 9.12,7.25 8.25,7.25 8.25,5.12 8.38,5 8.38,2.25 8.12,2 6,2 J10.P$1
N$45
  Bottom 0.152: R15.2 32.88,11.5 34.75,13.38 35.62,13.38 36.38,14.12 36.38,15.62 34.5,15.62 32.88,14 R13.1 32.75,14 31.88,13.12 30.12,13.12 29.25,14 C19.1
N$46  (via drill 0.3)
  Top 0.152: v8.12,34.12 9.62,32.62 v9.62,21.88
  Bottom 0.152: 7.75,35.75 7.75,38.5 R24.2 | 7.75,35.75 R25.1 7.75,35.75 | 7.75,35.75 7.75,34.12 v8.12,34.12 | v9.62,21.88 9.88,21.62 20.5,21.62 21.62,20.5 24.75,20.5 25.5,21.25 30.5,21.25 32.12,19.62 32.12,19.12 IC6.1
N$47
  Bottom 0.152: R57.2 19,5.62 16.25,5.62 Q5.B
N$48  (via drill 0.3)
  Top 0.152: v2.5,52.75 2,52.25 2,46.75 v4.38,44.38 | v17.88,43.5 19.12,42.25 v19.12,29.25
  Bottom 0.152: v2.5,52.75 2.5,54.12 R60.2 | v4.38,44.38 4.62,44.12 10.5,44.12 11.12,43.5 v17.88,43.5 | v19.12,29.25 19.88,28.5 26.75,28.5 27.62,27.62 28.75,27.62 29,27.88 29,29.38 33.25,29.38 35.5,27.12 35.62,27.12 37.12,25.62 37.12,17.5 35.25,17.5 J8.P$2
N$56
  Top 0.152: JP1.2 37.88,62 37.88,59.62 JP1.1
  Bottom 0.152: D1.A 37.88,51.88 37.88,59.5 JP1.1
N$57
  Bottom 0.152: J4.P$1 0.38,40.5 0.38,5.12 4.62,0.88 39.25,0.88 39.25,6.5 38.5,7.25 R55.1
N$64  (via drill 0.3)
  Top 0.152: v28,64.88 27.75,64.62 27.75,62.12 JP1.10 27.75,62 27.75,59.62 JP1.9
  Bottom 0.152: v28,64.88 28,66 D2.C
N$66
  Bottom 0.152: R55.2 38.38,5.62 35.75,5.62 Q2.B
N$67  (via drill 0.3)
  Top 0.152: v31.38,35.75 31.5,35.62 v31.5,22.75
  Bottom 0.152: v31.38,35.75 33.12,37.5 C21.2 | IC6.3 29.75,19 29.75,17.62 32.5,17.62 32.75,17.88 32.75,22.75 v31.5,22.75 31.5,24.25 31,24.25 IC6.7 30.88,24.25 29.75,24.25 IC6.6
N$69  (via drill 0.3)
  Top 0.152: v30.88,22.25 v30.88,33.12
  Bottom 0.152: C23.1 38.38,37.5 38.38,35 R16.1 38.25,35 36.38,33.12 v30.88,33.12 | v30.88,22.25 30.25,22.88 29.25,22.88 28.38,23.75 28.38,24.25 IC6.5
N$71
  Bottom 0.152: 34.88,35 36.62,35 R16.2 | 34.88,35 R14.1 34.88,35 | 34.88,35 34.88,37.5 C21.1
PROC_ADC  (via drill 0.3)
  Top 0.152: v16.88,29.75 v16.88,31.5 17.25,31.88 17.25,44.12 20.38,44.12 23,46.75 23,52.25 21.5,53.75 21.5,58 20.5,59 v20.5,70.25
  Bottom 0.152: UC1.17 25.88,79.5 26.5,78.88 27.25,78.88 28.88,77.25 C28.2 29,77.25 29.88,78.12 31.25,78.12 31.5,77.88 31.5,74.25 28.25,74.25 24.25,70.25 v20.5,70.25 | v16.88,29.75 17.62,29.75 17.62,28.75 R33.1 | v16.88,31.5 16.88,32.25 17.25,32.25 IC9.8
RANGE_SW  (via drill 0.3)
  Top 0.152: v27.88,83.88 28.75,84.75 28.75,89.75 31.62,92.62 31.62,102.62 S2.3
  Bottom 0.152: v27.88,83.88 27.38,83.88 27,83.5 UC1.11 | S2.4 S2.3
RESET  (via drill 0.3)
  Top 0.152: v24.38,84.5 24.25,84.62 v24.25,90 | v1,96.88 1,90.88 2.12,89.75 JP2.10
  Bottom 0.152: v24.38,84.5 25.12,84.5 25.38,84.75 UC1.7 | v24.25,90 15.62,98.62 2.75,98.62 2,97.88 R11.1 2,97.75 1.88,97.75 v1,96.88
SHAPE_ADC  (via drill 0.3)
  Top 0.152: v27.25,79.5 27,79.25 27,63.12 26.25,62.38 v26.25,46.5 26.25,40.62 v25.62,40
  Bottom 0.152: v27.25,79.5 26.62,80.12 UC1.15 | v26.25,46.5 26.5,46.25 29.12,46.25 29.75,45.62 29.75,45 C32.2 29.88,45 29.88,42.25 R40.1 | v25.62,40 23.5,40 IC9.1
START  (via drill 0.3)
  Top 0.152: v24.38,73.38 23.38,72.38 23.38,70.75 22.5,69.88 22.5,67.88 v22.62,67.75 | v31.12,6.5 30.5,7.12 30.5,11.38 35.5,16.38 38.12,16.38 38.12,53.12 33,58.25 28.88,58.25 28.88,66.5 v27.62,67.75
  Bottom 0.152: v24.38,73.38 25.5,73.38 25.5,75.12 25.25,75.38 25,75.38 25,76.75 24.12,77.62 UC1.22 | R47.1 21.38,66.5 v22.62,67.75 v27.62,67.75 | v31.12,6.5 32.62,6.5 32.88,6.75 33.62,6.75 34.75,7.88 Q2.C
UNI  (via drill 0.3)
  Top 0.152: v9.12,69.25 10.25,68.12 v10.25,49.75
  Bottom 0.152: v9.12,69.25 9.12,73.25 9.38,73.5 9.38,75.75 IC4.4 | v10.25,49.75 11.25,48.75 26.25,48.75 28.38,46.62 29.62,46.62 30.75,45.5 30.75,35 33.12,35 R14.2
UNI_OUT  (via drill 0.3)
  Top 0.152: v9.38,36.88 10.12,36.12 10.12,23.75 10.88,23 10.88,5 10.75,4.88 10.75,4.38 13.25,1.88 25.12,1.88 J12.P$1
  Bottom 0.152: v9.38,36.88 9.38,38.5 R24.1
VCC  (via drill 0.3)
  Top 0.152: v13.88,49.75 12.62,51 12.62,53.25 | 12.62,53.25 12.62,56.75 v11.62,57.75 | 12.62,53.25 v13.5,53.25 | v21.12,6.5 21.88,7.25 21.88,24 v22.12,24.25 | v34,43.75 32.12,41.88 v32.12,26.38
  Bottom 0.152: 29,53.38 32.5,53.38 34,51.88 D1.C 34,51.75 v34,43.75 | 29,53.38 C3.+ 29,53.38 | 8.5,57.38 8.88,57.38 9.12,57.62 IC3.3 | 8.5,57.38 3.88,57.38 R60.1 | v13.88,49.75 15.25,51.12 IC1.3 | v11.62,57.75 9.25,57.75 IC3.3 | 8.5,57.38 8.5,54.38 8.25,54.12 7.12,54.12 3.38,50.38 C8.+ | 8.5,57.38 IC3.3 | 29,53.38 28.88,53.25 v13.5,53.25 | 16.12,7.12 15.88,6.88 14,6.88 13.62,6.5 10,6.5 9.25,5.75 R51.2 | 16.12,7.12 16.12,9.12 10,9.12 9.38,9.75 9.38,10.62 R53.2 | C18.1 36.38,20 36.38,23 C20.1 36.25,23 34.5,24.75 32.75,24.75 32.5,24.5 | 32.5,24.5 32.25,24.25 IC6.8 | 21.75,24.62 22,24.88 26.62,24.88 27.38,25.62 31.38,25.62 | 21.75,24.62 21.38,24.25 IC5.8 | 32.5,24.5 31.38,25.62 | 16.12,7.12 16.5,6.75 18.12,6.75 18.38,6.5 v21.12,6.5 | 21.75,24.62 v22.12,24.25 | 31.38,25.62 v32.12,26.38
VEE  (via drill 0.3)
  Top 0.152: v17.12,14.75 v17.12,13.5 | v39.12,19 v39.12,67.5
  Bottom 0.152: R27.1 33.5,73.5 36,76 36.5,76 C10.- | 33.38,73.25 33.5,73.38 R27.1 | 33.38,73.25 30.88,70.75 28.75,70.75 28,70 D2.A | v17.12,13.5 18.12,12.5 C25.2 | v17.12,14.75 17.38,15 17.5,15 | 17.5,15 18.12,15 C24.2 | 17.5,16.38 17.5,19 IC5.4 | 17.5,16.38 17.5,15 | 25.62,16.38 28.25,19 IC6.4 | 17.5,16.38 25.62,16.38 | v39.12,67.5 33.38,73.25 | v39.12,19 36.5,16.38 25.62,16.38 | 33.38,73.25 R27.1
VOCT_ADC  (via drill 0.3)
  Top 0.152: v23.88,81.38 19.88,85.38 v19.88,90 | v7.38,17 6.12,15.75 6.12,14.12 5.38,13.38 1.62,13.38 1.62,61.62 5.25,65.25 5.25,86.62 v13,94.38
  Bottom 0.152: v23.88,81.38 26.75,81.38 27.12,81 UC1.13 | v19.88,90 16.62,93.25 13.38,93.25 R37.1 13.38,93.38 13.38,94.38 | 13.38,94.38 13.38,95.88 C31.2 | v7.38,17 11.38,17 11.38,19 IC8.1 | 13.38,94.38 v13,94.38

### Text on the board
bNames: uMotion | CC-BY-SA 3.0 | Red stripe | Original design by Olivier Gillet | mod by Codex Modulex - 2018 - v1.0